# EAGLE schematic Hackerboat Control Board (EAGLE 6.5.0)

## Sheet 1 of 7
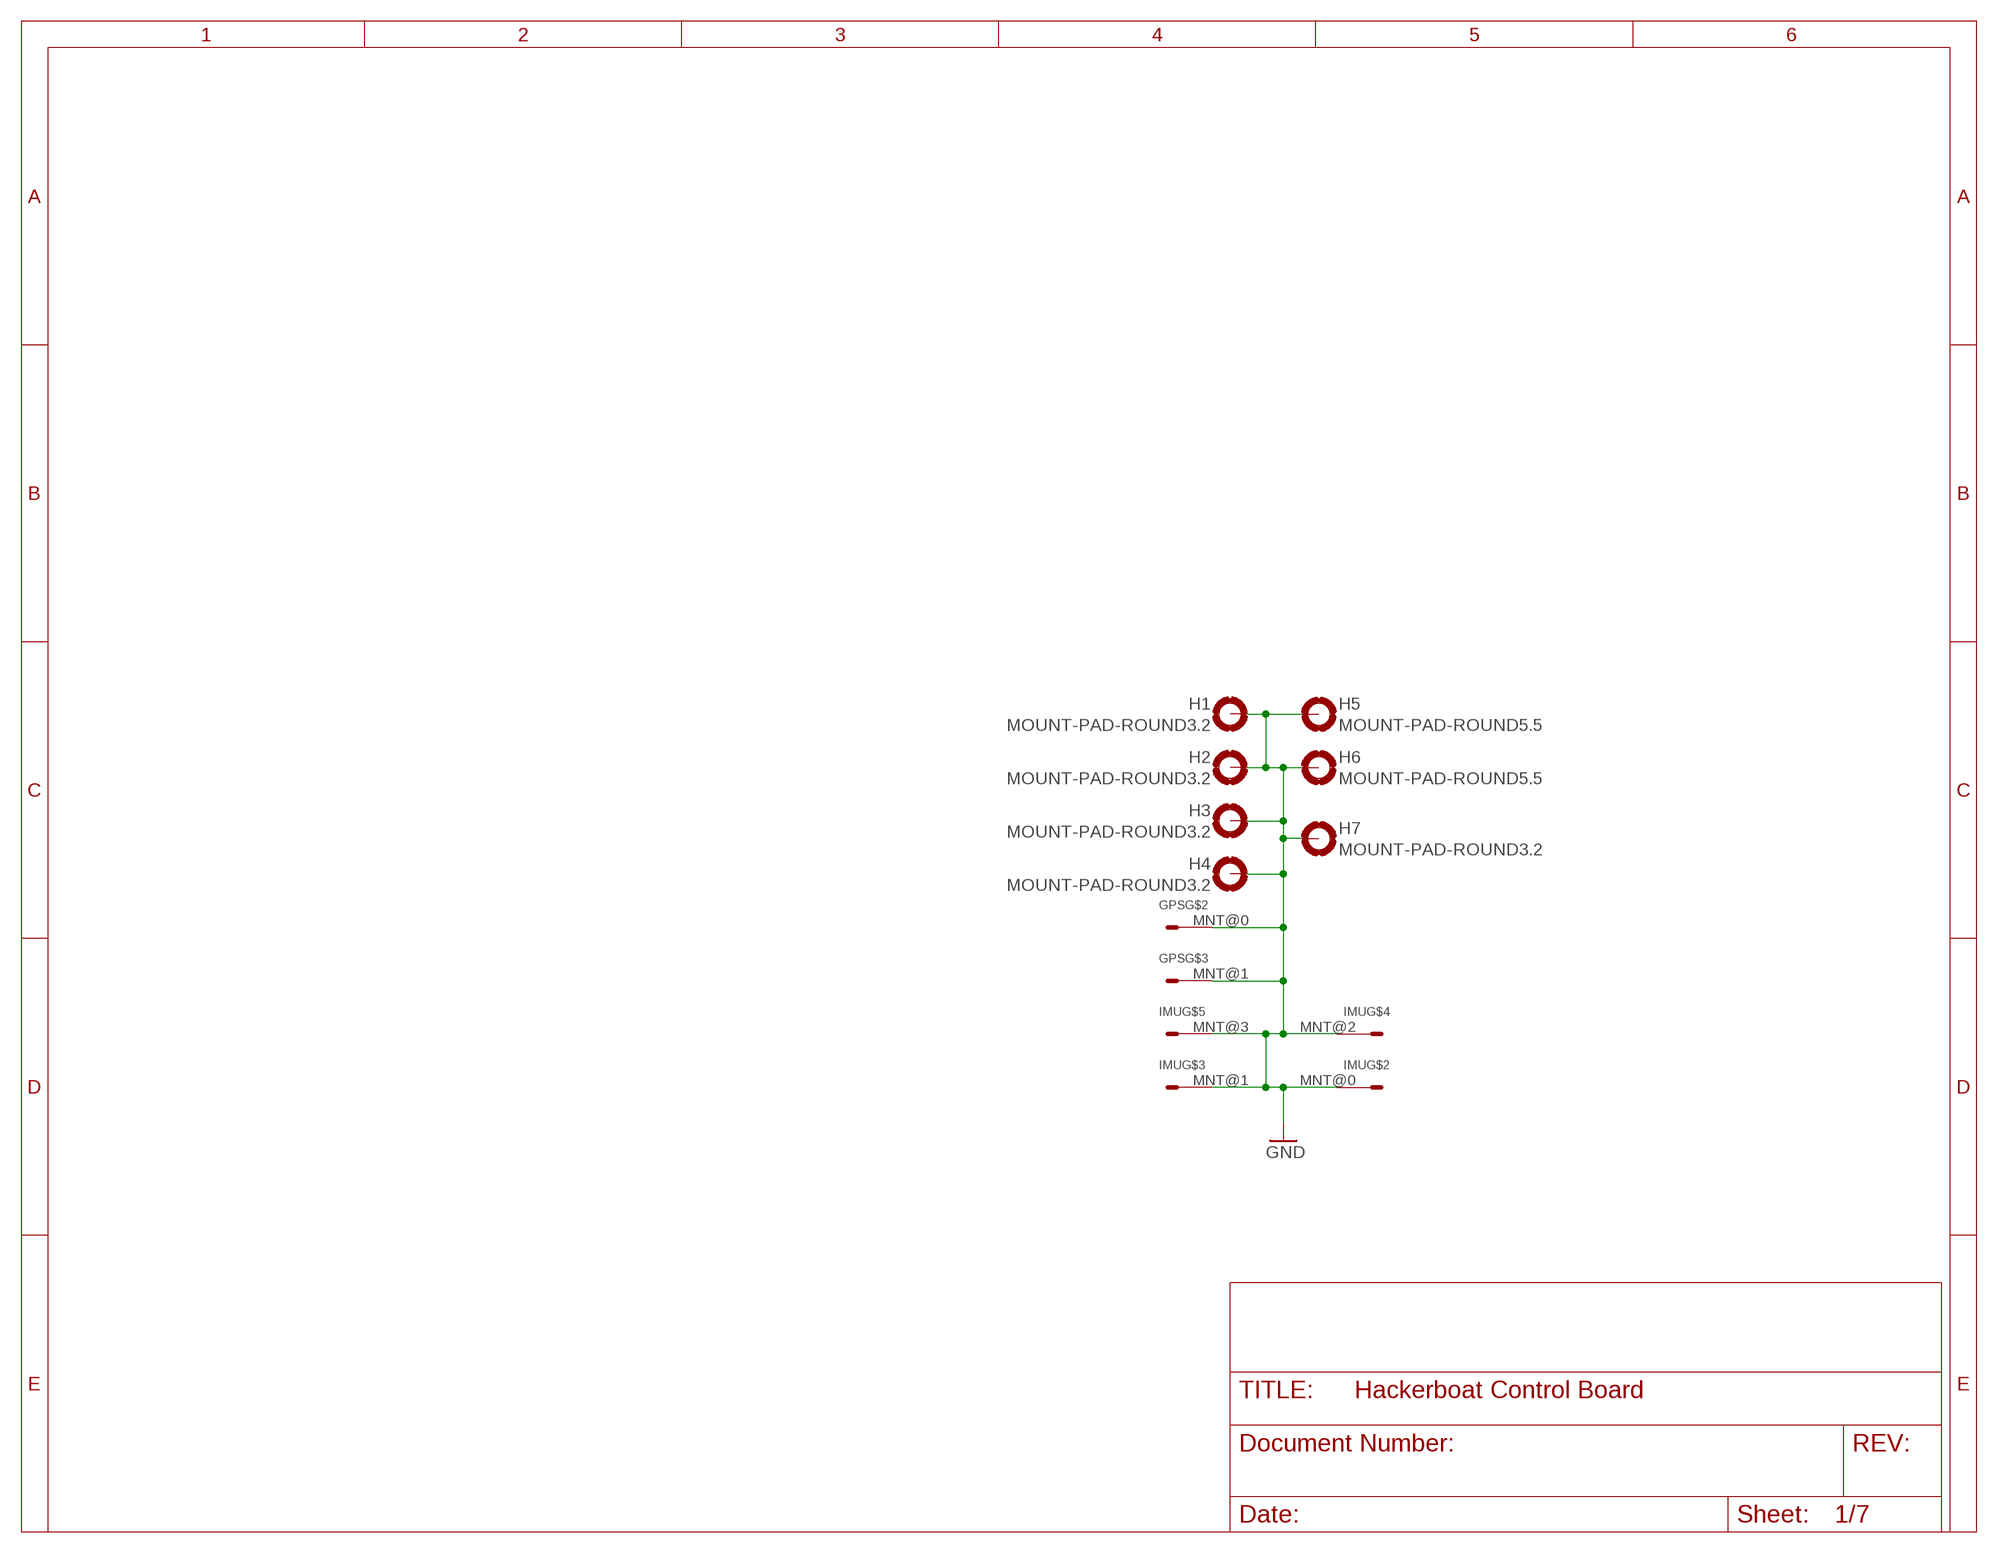
[diagram p0: schematic, sheet 1]

### Parts
GPS  ULTIMATE-GPS  [ULTIMATE-GPS]
H1  MOUNT-PAD-ROUND3.2  [3,2-PAD]
H2  MOUNT-PAD-ROUND3.2  [3,2-PAD]
H3  MOUNT-PAD-ROUND3.2  [3,2-PAD]
H4  MOUNT-PAD-ROUND3.2  [3,2-PAD]
H5  MOUNT-PAD-ROUND5.5  [5,5-PAD]
H6  MOUNT-PAD-ROUND5.5  [5,5-PAD]
H7  MOUNT-PAD-ROUND3.2  [3,2-PAD]
IMU  9-DOF-BREAKOUT  [9-DOF-BREAKOUT]

### Nets
GND: GPS.MNT@0 GPS.MNT@1 H1.B3,2(MOUNT) H2.B3,2(MOUNT) H3.B3,2(MOUNT) H4.B3,2(MOUNT) H5.B5,5(MOUNT) H6.B5,5(MOUNT) H7.B3,2(MOUNT) IMU.MNT@0 IMU.MNT@1 IMU.MNT@2 IMU.MNT@3 ; also sheet 2,3,4,5,6,7

## Sheet 2 of 7
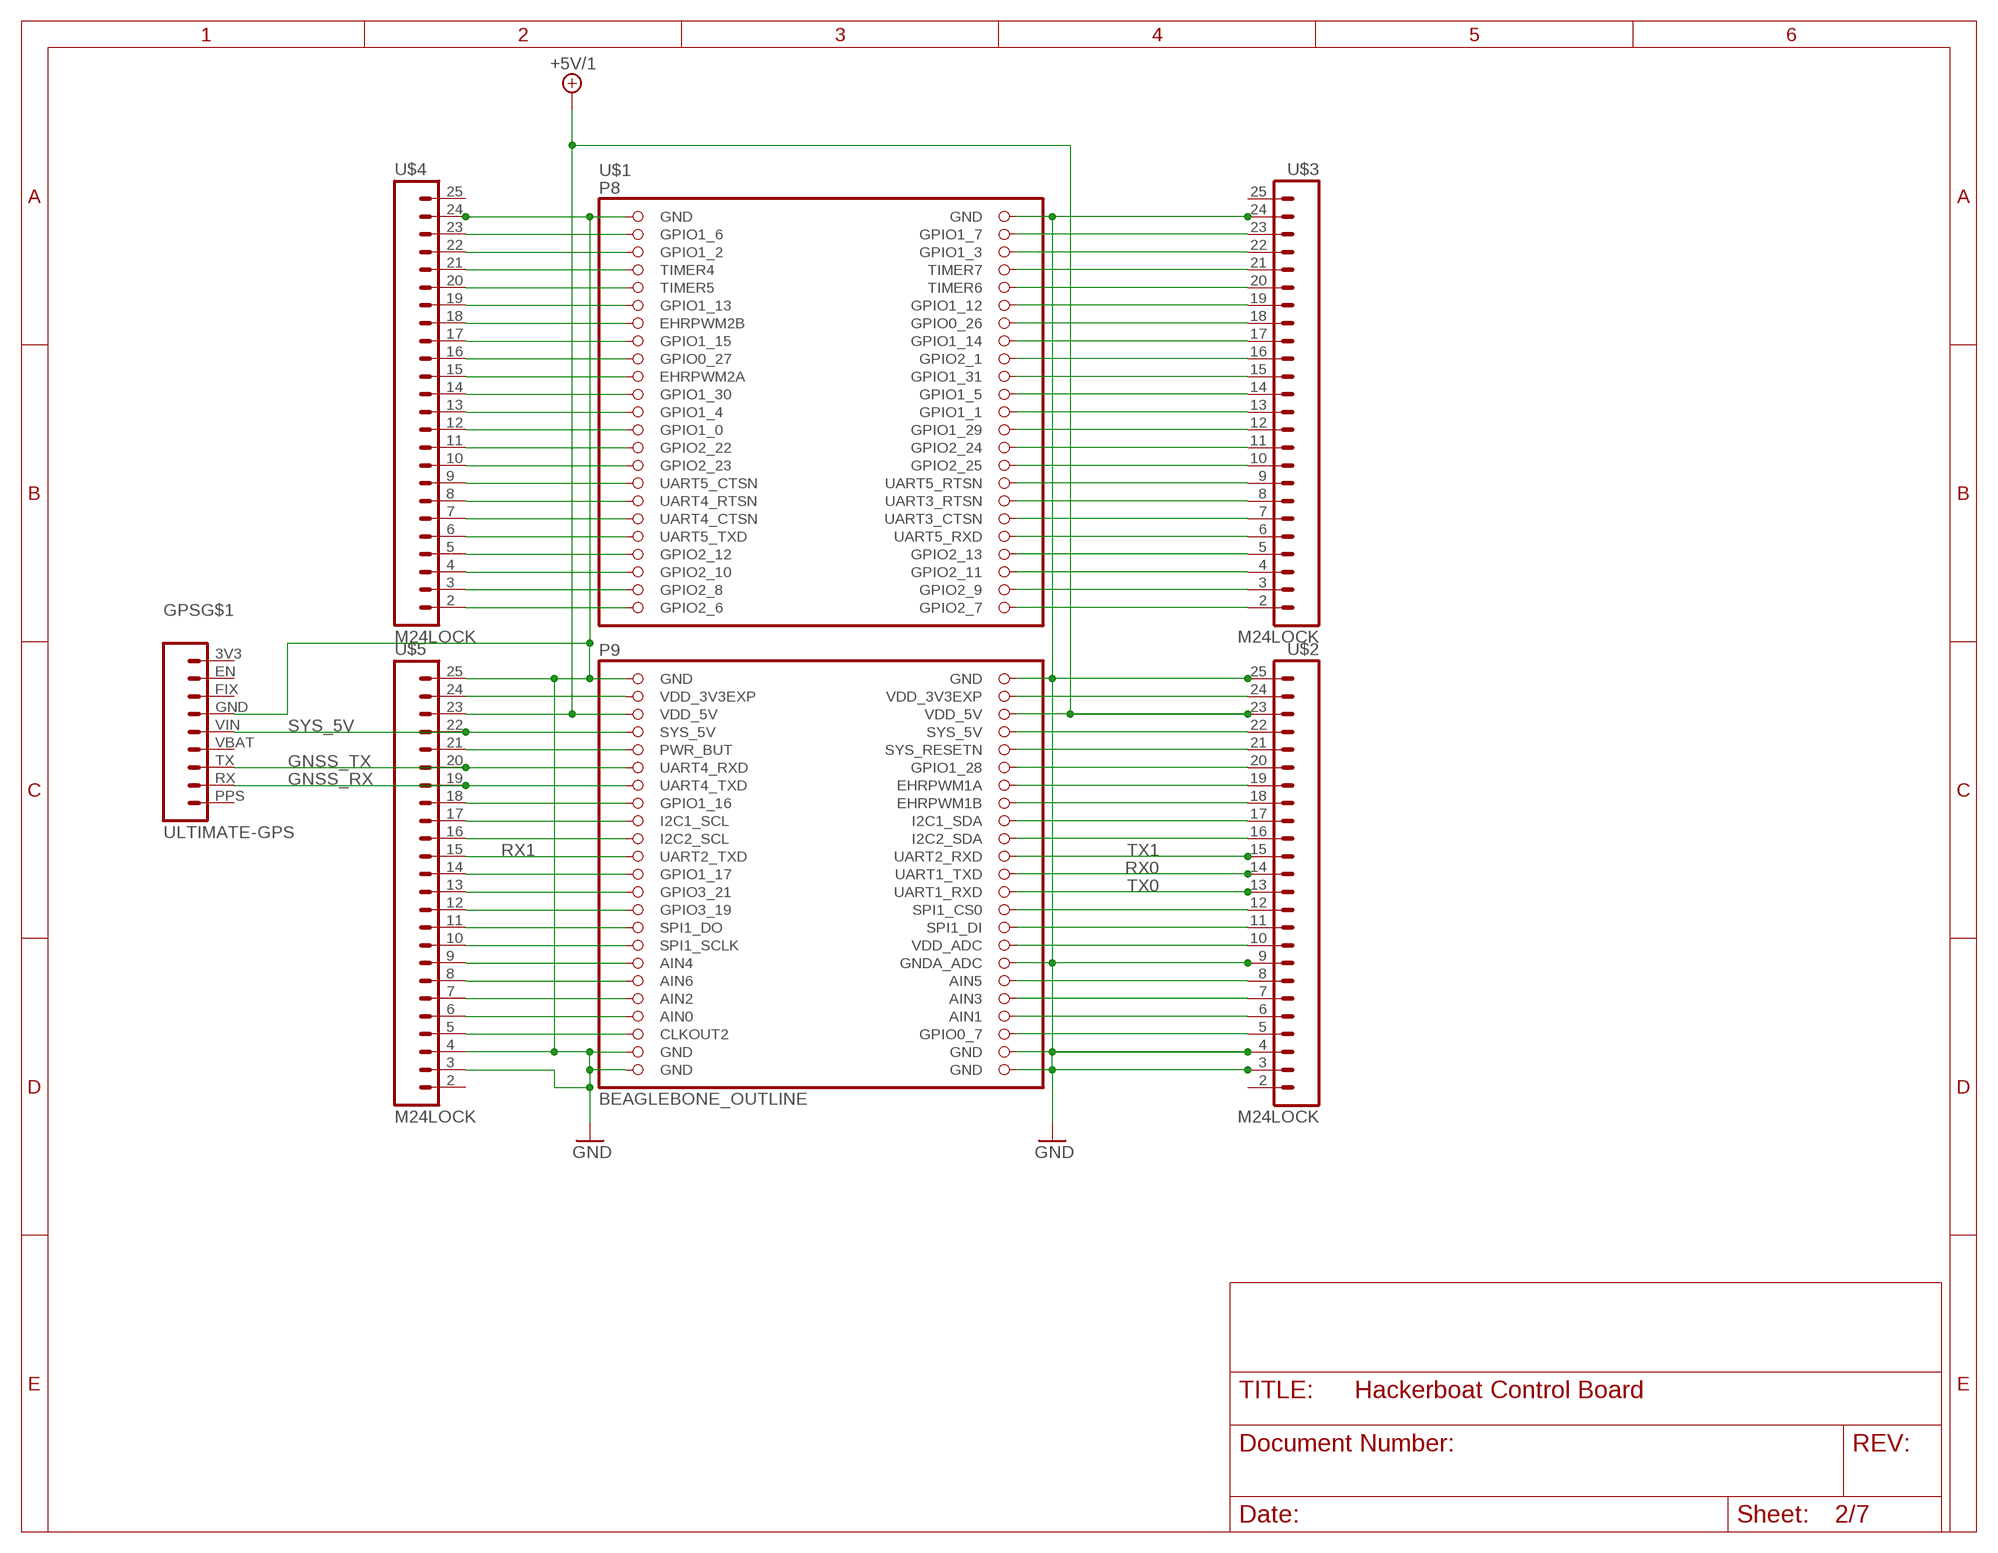
[diagram p1: schematic, sheet 2]

### Parts
U$1  BEAGLEBONE_OUTLINE  [BEAGLEBONE_SHIELD]
U$2  M24LOCK  [1X24_LOCK]
U$3  M24LOCK  [1X24_LOCK]
U$4  M24LOCK  [1X24_LOCK]
U$5  M24LOCK  [1X24_LOCK]

### Nets
+5V/1: U$1.51(VDD_5V) U$1.52(VDD_5V) U$2.23 U$5.23 ; also sheet 6
GND: GPS.GND U$1.1(GND) U$1.2(GND) U$1.47(GND) U$1.48(GND) U$1.80(GNDA_ADC) U$1.89(GND) U$1.90(GND) U$1.91(GND) U$1.92(GND) U$2.3 U$2.4 U$2.9 U$2.25 U$3.24 U$4.24 U$5.3 U$5.4 U$5.25 ; also sheet 1,3,4,5,6,7
GNSS_RX: GPS.RX U$1.59(UART4_TXD) U$5.19
GNSS_TX: GPS.TX U$1.57(UART4_RXD) U$5.20
N$71: U$1.49(VDD_3V3EXP) U$5.24
N$104: U$1.88(GPIO0_7) U$2.5
N$105: U$1.86(AIN1) U$2.6
N$106: U$1.84(AIN3) U$2.7
N$107: U$1.82(AIN5) U$2.8
N$108: U$1.78(VDD_ADC) U$2.10
N$109: U$1.76(SPI1_DI) U$2.11
N$110: U$1.74(SPI1_CS0) U$2.12
N$111: U$1.66(I2C2_SDA) U$2.16
N$112: U$1.64(I2C1_SDA) U$2.17
N$113: U$1.62(EHRPWM1B) U$2.18
N$114: U$1.60(EHRPWM1A) U$2.19
N$115: U$1.58(GPIO1_28) U$2.20
N$116: U$1.56(SYS_RESETN) U$2.21
N$117: U$1.54(SYS_5V) U$2.22
N$118: U$1.50(VDD_3V3EXP) U$2.24
N$119: U$1.46(GPIO2_7) U$3.2
N$120: U$1.44(GPIO2_9) U$3.3
N$121: U$1.42(GPIO2_11) U$3.4
N$122: U$1.40(GPIO2_13) U$3.5
N$123: U$1.38(UART5_RXD) U$3.6
N$124: U$1.36(UART3_CTSN) U$3.7
N$125: U$1.34(UART3_RTSN) U$3.8
N$126: U$1.32(UART5_RTSN) U$3.9
N$127: U$1.30(GPIO2_25) U$3.10
N$128: U$1.28(GPIO2_24) U$3.11
N$129: U$1.26(GPIO1_29) U$3.12
N$130: U$1.24(GPIO1_1) U$3.13
N$131: U$1.22(GPIO1_5) U$3.14
N$132: U$1.20(GPIO1_31) U$3.15
N$133: U$1.18(GPIO2_1) U$3.16
N$134: U$1.16(GPIO1_14) U$3.17
N$135: U$1.14(GPIO0_26) U$3.18
N$136: U$1.12(GPIO1_12) U$3.19
N$137: U$1.10(TIMER6) U$3.20
N$138: U$1.8(TIMER7) U$3.21
N$139: U$1.6(GPIO1_3) U$3.22
N$140: U$1.4(GPIO1_7) U$3.23
N$141: U$1.45(GPIO2_6) U$4.2
N$142: U$1.43(GPIO2_8) U$4.3
N$143: U$1.41(GPIO2_10) U$4.4
N$144: U$1.39(GPIO2_12) U$4.5
N$145: U$1.37(UART5_TXD) U$4.6
N$146: U$1.35(UART4_CTSN) U$4.7
N$147: U$1.33(UART4_RTSN) U$4.8
N$148: U$1.31(UART5_CTSN) U$4.9
N$149: U$1.29(GPIO2_23) U$4.10
N$150: U$1.27(GPIO2_22) U$4.11
N$151: U$1.25(GPIO1_0) U$4.12
N$152: U$1.23(GPIO1_4) U$4.13
N$153: U$1.21(GPIO1_30) U$4.14
N$154: U$1.19(EHRPWM2A) U$4.15
N$155: U$1.17(GPIO0_27) U$4.16
N$156: U$1.15(GPIO1_15) U$4.17
N$157: U$1.13(EHRPWM2B) U$4.18
N$158: U$1.11(GPIO1_13) U$4.19
N$159: U$1.9(TIMER5) U$4.20
N$160: U$1.7(TIMER4) U$4.21
N$161: U$1.5(GPIO1_2) U$4.22
N$162: U$1.3(GPIO1_6) U$4.23
N$163: U$1.87(CLKOUT2) U$5.5
N$164: U$1.85(AIN0) U$5.6
N$165: U$1.83(AIN2) U$5.7
N$166: U$1.81(AIN6) U$5.8
N$167: U$1.79(AIN4) U$5.9
N$168: U$1.77(SPI1_SCLK) U$5.10
N$169: U$1.75(SPI1_DO) U$5.11
N$170: U$1.73(GPIO3_19) U$5.12
N$171: U$1.71(GPIO3_21) U$5.13
N$172: U$1.69(GPIO1_17) U$5.14
N$173: U$1.65(I2C2_SCL) U$5.16
N$174: U$1.63(I2C1_SCL) U$5.17
N$175: U$1.61(GPIO1_16) U$5.18
N$176: U$1.55(PWR_BUT) U$5.21
RX0: U$1.70(UART1_TXD) U$2.14 ; also sheet 3
RX1: U$1.67(UART2_TXD) U$5.15 ; also sheet 3
SYS_5V: GPS.VIN U$1.53(SYS_5V) U$5.22
TX0: U$1.72(UART1_RXD) U$2.13 ; also sheet 3
TX1: U$1.68(UART2_RXD) U$2.15 ; also sheet 3
Unconnected: GPS.3V3 GPS.EN GPS.FIX GPS.PPS GPS.VBAT U$2.2 U$3.25 U$4.25 U$5.2

## Sheet 3 of 7
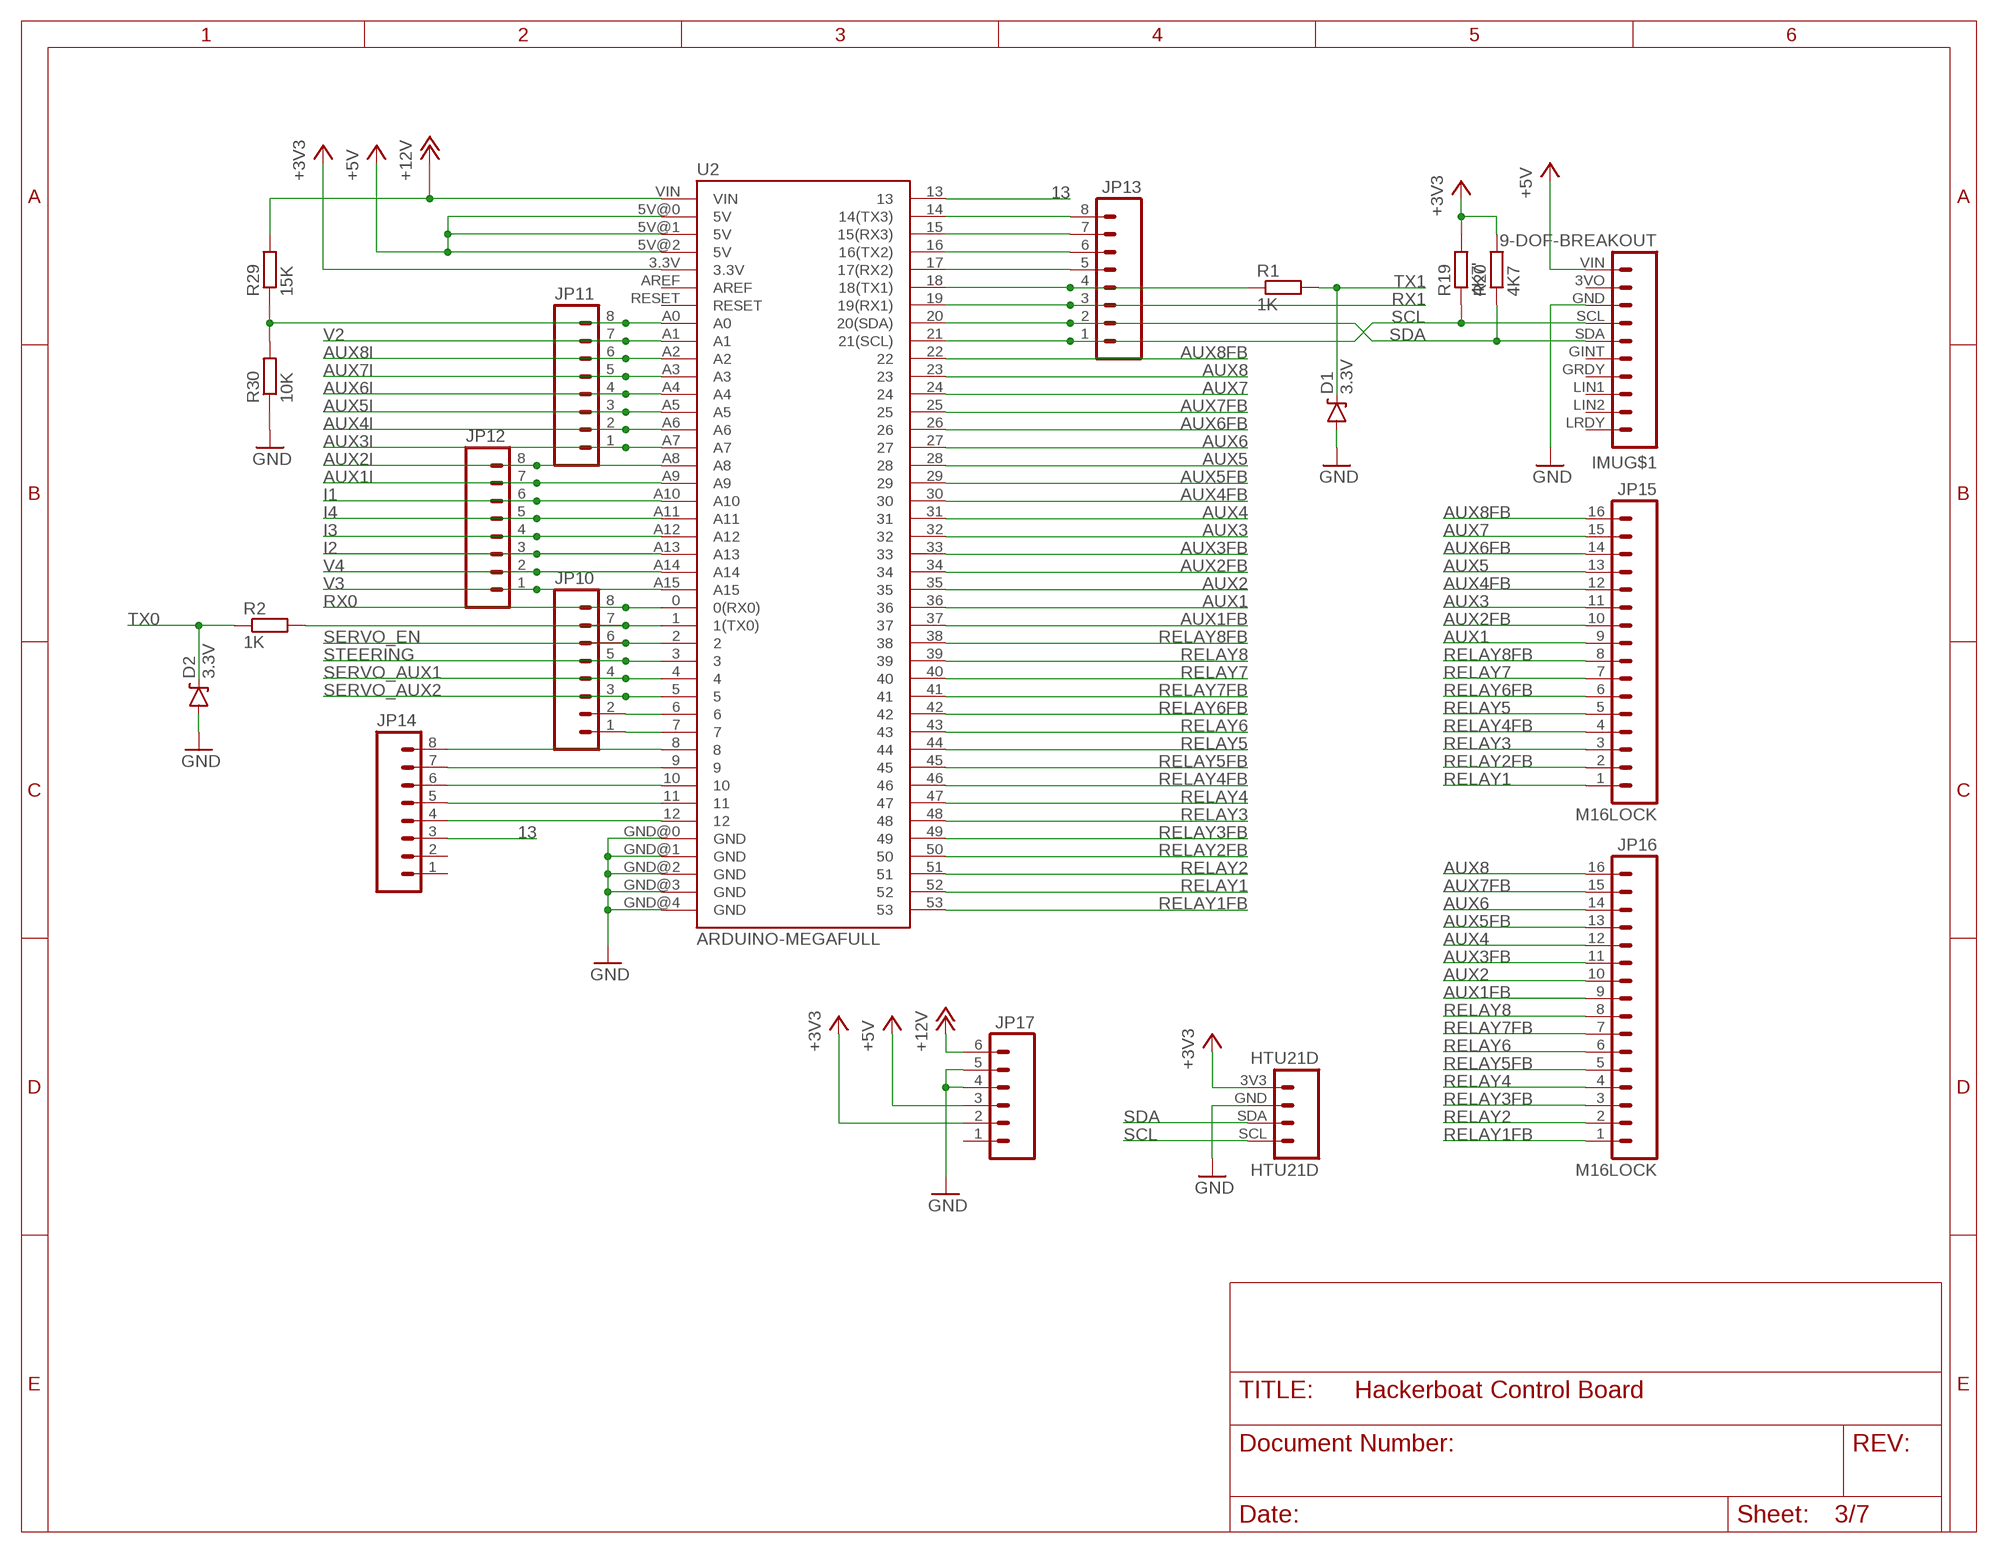
[diagram p2: schematic, sheet 3]

### Parts
D1  3.3V  DIODE-ZENER3.3V  [SOD-323]
D2  3.3V  DIODE-ZENER3.3V  [SOD-323]
HTU21D  HTU21D  [HTU21D]
JP10  M08LOCK  [1X08_LOCK]
JP11  M08LOCK  [1X08_LOCK]
JP12  M08LOCK  [1X08_LOCK]
JP13  M08LOCK  [1X08_LOCK]
JP14  M08LOCK  [1X08_LOCK]
JP15  M16LOCK  [1X16_LOCK]
JP16  M16LOCK  [1X16_LOCK]
JP17  M06LOCK  [1X06_LOCK]
R1  1K  R-EU_R0603  [R0603]
R2  1K  R-EU_R0603  [R0603]
R19  4K7'  R-EU_R0603  [R0603]
R20  4K7  R-EU_R0603  [R0603]
R29  15K  R-EU_R0603  [R0603]
R30  10K  R-EU_R0603  [R0603]
U2  ARDUINO-MEGAFULL  [ARDUINO_MEGA]

### Nets
13: JP14.3 U2.13
+3V3: HTU21D.3V3 JP17.2 R19.2 R20.2 U2.3.3V
+5V: IMU.VIN JP17.3 U2.5V@0(5V) U2.5V@1(5V) U2.5V@2(5V) ; also sheet 4,5,7
+12V: JP17.6 R29.2 U2.VIN ; also sheet 4,5,6
AUX1: JP15.9 U2.36 ; also sheet 5
AUX1FB: JP16.9 U2.37 ; also sheet 5
AUX1I: JP12.7 U2.A9 ; also sheet 5
AUX2: JP16.10 U2.35 ; also sheet 5
AUX2FB: JP15.10 U2.34 ; also sheet 5
AUX2I: JP12.8 U2.A8 ; also sheet 5
AUX3: JP15.11 U2.32 ; also sheet 5
AUX3FB: JP16.11 U2.33 ; also sheet 5
AUX3I: JP11.1 U2.A7 ; also sheet 5
AUX4: JP16.12 U2.31 ; also sheet 5
AUX4FB: JP15.12 U2.30 ; also sheet 5
AUX4I: JP11.2 U2.A6 ; also sheet 5
AUX5: JP15.13 U2.28 ; also sheet 5
AUX5FB: JP16.13 U2.29 ; also sheet 5
AUX5I: JP11.3 U2.A5 ; also sheet 5
AUX6: JP16.14 U2.27 ; also sheet 5
AUX6FB: JP15.14 U2.26 ; also sheet 5
AUX6I: JP11.4 U2.A4 ; also sheet 5
AUX7: JP15.15 U2.24 ; also sheet 5
AUX7FB: JP16.15 U2.25 ; also sheet 5
AUX7I: JP11.5 U2.A3 ; also sheet 5
AUX8: JP16.16 U2.23 ; also sheet 5
AUX8FB: JP15.16 U2.22 ; also sheet 5
AUX8I: JP11.6 U2.A2 ; also sheet 5
GND: D1.A D2.A HTU21D.GND IMU.GND JP17.4 JP17.5 R30.1 U2.GND@0(GND) U2.GND@1(GND) U2.GND@2(GND) U2.GND@3(GND) U2.GND@4(GND) ; also sheet 1,2,4,5,6,7
I1: JP12.6 U2.A10 ; also sheet 7
I2: JP12.3 U2.A13 ; also sheet 7
I3: JP12.4 U2.A12 ; also sheet 7
I4: JP12.5 U2.A11 ; also sheet 7
N$3: JP13.4 R1.1 U2.18(18(TX1))
N$4: JP10.7 R2.2 U2.1(1(TX0))
N$91: JP10.1 U2.7
N$92: JP10.2 U2.6
N$94: JP11.8 R29.1 R30.2 U2.A0
N$95: JP13.5 U2.17(17(RX2))
N$96: JP13.6 U2.16(16(TX2))
N$97: JP13.7 U2.15(15(RX3))
N$98: JP13.8 U2.14(14(TX3))
N$99: JP14.8 U2.8
N$100: JP14.7 U2.9
N$101: JP14.6 U2.10
N$102: JP14.5 U2.11
N$103: JP14.4 U2.12
RELAY1: JP15.1 U2.52 ; also sheet 4
RELAY1FB: JP16.1 U2.53 ; also sheet 4
RELAY2: JP16.2 U2.51 ; also sheet 4
RELAY2FB: JP15.2 U2.50 ; also sheet 4
RELAY3: JP15.3 U2.48 ; also sheet 4
RELAY3FB: JP16.3 U2.49 ; also sheet 4
RELAY4: JP16.4 U2.47 ; also sheet 4
RELAY4FB: JP15.4 U2.46 ; also sheet 4
RELAY5: JP15.5 U2.44 ; also sheet 4
RELAY5FB: JP16.5 U2.45 ; also sheet 4
RELAY6: JP16.6 U2.43 ; also sheet 4
RELAY6FB: JP15.6 U2.42 ; also sheet 4
RELAY7: JP15.7 U2.40 ; also sheet 4
RELAY7FB: JP16.7 U2.41 ; also sheet 4
RELAY8: JP16.8 U2.39 ; also sheet 4
RELAY8FB: JP15.8 U2.38 ; also sheet 4
RX0: JP10.8 U2.0(0(RX0)) ; also sheet 2
RX1: JP13.3 U2.19(19(RX1)) ; also sheet 2
SCL: HTU21D.SCL IMU.SCL JP13.1 R19.1 U2.21(21(SCL))
SDA: HTU21D.SDA IMU.SDA JP13.2 R20.1 U2.20(20(SDA))
SERVO_AUX1: JP10.4 U2.4 ; also sheet 7
SERVO_AUX2: JP10.3 U2.5 ; also sheet 7
SERVO_EN: JP10.6 U2.2 ; also sheet 6
STEERING: JP10.5 U2.3 ; also sheet 7
TX0: D2.C R2.1 ; also sheet 2
TX1: D1.C R1.2 ; also sheet 2
V2: JP11.7 U2.A1 ; also sheet 7
V3: JP12.1 U2.A15 ; also sheet 7
V4: JP12.2 U2.A14 ; also sheet 7
Unconnected: IMU.3VO IMU.GINT IMU.GRDY IMU.LIN1 IMU.LIN2 IMU.LRDY JP14.1 JP14.2 JP17.1 U2.AREF U2.RESET

## Sheet 4 of 7
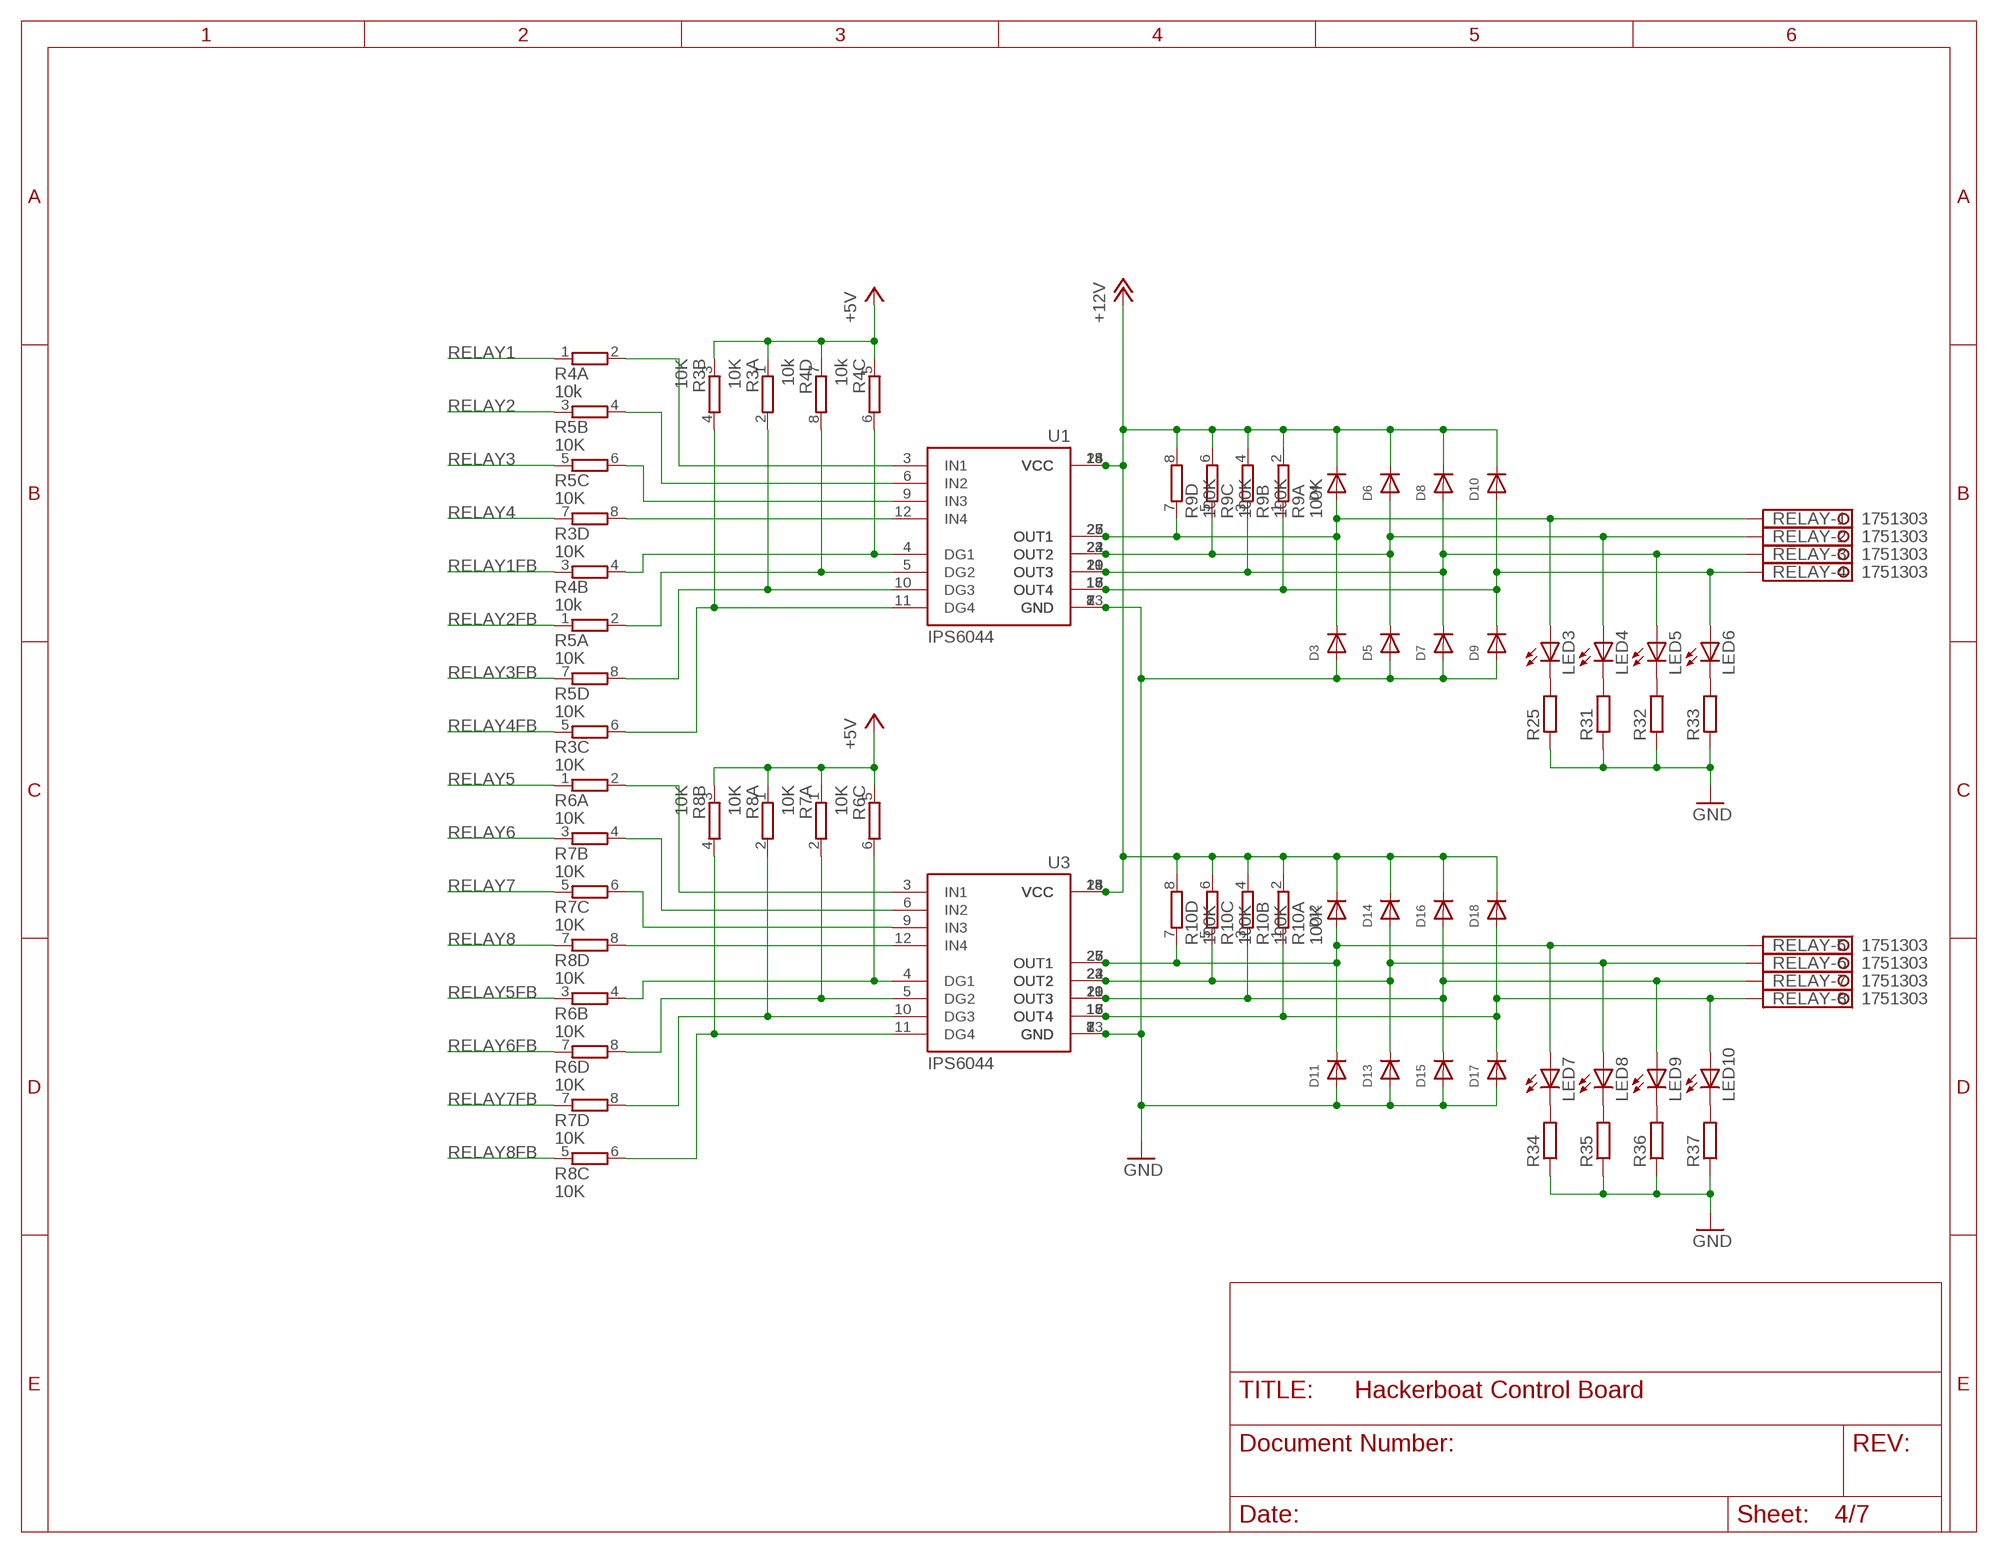
[diagram p3: schematic, sheet 4]

### Parts
D3  DIODESOD-123  [SOD-123]
D4  DIODESOD-123  [SOD-123]
D5  DIODESOD-123  [SOD-123]
D6  DIODESOD-123  [SOD-123]
D7  DIODESOD-123  [SOD-123]
D8  DIODESOD-123  [SOD-123]
D9  DIODESOD-123  [SOD-123]
D10  DIODESOD-123  [SOD-123]
D11  DIODESOD-123  [SOD-123]
D12  DIODESOD-123  [SOD-123]
D13  DIODESOD-123  [SOD-123]
D14  DIODESOD-123  [SOD-123]
D15  DIODESOD-123  [SOD-123]
D16  DIODESOD-123  [SOD-123]
D17  DIODESOD-123  [SOD-123]
D18  DIODESOD-123  [SOD-123]
LED3  LEDCHIPLED_0805  [CHIPLED_0805]
LED4  LEDCHIPLED_0805  [CHIPLED_0805]
LED5  LEDCHIPLED_0805  [CHIPLED_0805]
LED6  LEDCHIPLED_0805  [CHIPLED_0805]
LED7  LEDCHIPLED_0805  [CHIPLED_0805]
LED8  LEDCHIPLED_0805  [CHIPLED_0805]
LED9  LEDCHIPLED_0805  [CHIPLED_0805]
LED10  LEDCHIPLED_0805  [CHIPLED_0805]
R3  10K  4R-NCTS742C083  [CTS742C083-RES]
R4  10k  4R-NCTS742C083  [CTS742C083-RES]
R5  10K  4R-NCTS742C083  [CTS742C083-RES]
R6  10K  4R-NCTS742C083  [CTS742C083-RES]
R7  10K  4R-NCTS742C083  [CTS742C083-RES]
R8  10K  4R-NCTS742C083  [CTS742C083-RES]
R9  100K  4R-NCTS742C083  [CTS742C083-RES]
R10  100K  4R-NCTS742C083  [CTS742C083-RES]
R25  R-EU_R0603  [R0603]
R31  R-EU_R0603  [R0603]
R32  R-EU_R0603  [R0603]
R33  R-EU_R0603  [R0603]
R34  R-EU_R0603  [R0603]
R35  R-EU_R0603  [R0603]
R36  R-EU_R0603  [R0603]
R37  R-EU_R0603  [R0603]
RELAY  1751303  [1751303]
U1  IPS6044  [SO-28L]
U3  IPS6044  [SO-28L]

### Nets
+5V: R3.1 R3.3 R4.5 R4.7 R6.5 R7.1 R8.1 R8.3 ; also sheet 3,5,7
+12V: D4.C D6.C D8.C D10.C D12.C D14.C D16.C D18.C R9.2 R9.4 R9.6 R9.8 R10.2 R10.4 R10.6 R10.8 U1.1(VCC) U1.14(VCC) U1.15(VCC) U1.28(VCC) U3.1(VCC) U3.14(VCC) U3.15(VCC) U3.28(VCC) ; also sheet 3,5,6
GND: D3.A D5.A D7.A D9.A D11.A D13.A D15.A D17.A R25.1 R31.1 R32.1 R33.1 R34.1 R35.1 R36.1 R37.1 U1.2(GND) U1.7(GND) U1.8(GND) U1.13(GND) U3.2(GND) U3.7(GND) U3.8(GND) U3.13(GND) ; also sheet 1,2,3,5,6,7
N$5: R6.2 U3.3(IN1)
N$6: R8.8 U3.12(IN4)
N$7: R7.6 U3.9(IN3)
N$8: D3.C D4.A LED3.A R9.7 RELAY.1 U1.25(OUT1) U1.26(OUT1) U1.27(OUT1)
N$9: D5.C D6.A LED4.A R9.5 RELAY.2 U1.22(OUT2) U1.23(OUT2) U1.24(OUT2)
N$10: D7.C D8.A LED5.A R9.3 RELAY.3 U1.19(OUT3) U1.20(OUT3) U1.21(OUT3)
N$11: D9.C D10.A LED6.A R9.1 RELAY.4 U1.16(OUT4) U1.17(OUT4) U1.18(OUT4)
N$12: R4.2 U1.3(IN1)
N$13: R5.4 U1.6(IN2)
N$14: R5.6 U1.9(IN3)
N$15: R3.8 U1.12(IN4)
N$16: R4.4 R4.6 U1.4(DG1)
N$17: R4.8 R5.2 U1.5(DG2)
N$18: R3.2 R5.8 U1.10(DG3)
N$19: R3.4 R3.6 U1.11(DG4)
N$20: R7.4 U3.6(IN2)
N$21: R6.8 R7.2 U3.5(DG2)
N$22: R6.4 R6.6 U3.4(DG1)
N$23: R7.8 R8.2 U3.10(DG3)
N$24: R8.4 R8.6 U3.11(DG4)
N$25: D11.C D12.A LED7.A R10.7 RELAY.5 U3.25(OUT1) U3.26(OUT1) U3.27(OUT1)
N$26: D13.C D14.A LED8.A R10.5 RELAY.6 U3.22(OUT2) U3.23(OUT2) U3.24(OUT2)
N$27: D15.C D16.A LED9.A R10.3 RELAY.7 U3.19(OUT3) U3.20(OUT3) U3.21(OUT3)
N$28: D17.C D18.A LED10.A R10.1 RELAY.8 U3.16(OUT4) U3.17(OUT4) U3.18(OUT4)
N$178: LED3.C R25.2
N$179: LED4.C R31.2
N$180: LED5.C R32.2
N$181: LED6.C R33.2
N$186: LED7.C R34.2
N$187: LED8.C R35.2
N$188: LED9.C R36.2
N$189: LED10.C R37.2
RELAY1: R4.1 ; also sheet 3
RELAY1FB: R4.3 ; also sheet 3
RELAY2: R5.3 ; also sheet 3
RELAY2FB: R5.1 ; also sheet 3
RELAY3: R5.5 ; also sheet 3
RELAY3FB: R5.7 ; also sheet 3
RELAY4: R3.7 ; also sheet 3
RELAY4FB: R3.5 ; also sheet 3
RELAY5: R6.1 ; also sheet 3
RELAY5FB: R6.3 ; also sheet 3
RELAY6: R7.3 ; also sheet 3
RELAY6FB: R6.7 ; also sheet 3
RELAY7: R7.5 ; also sheet 3
RELAY7FB: R7.7 ; also sheet 3
RELAY8: R8.7 ; also sheet 3
RELAY8FB: R8.5 ; also sheet 3

## Sheet 5 of 7
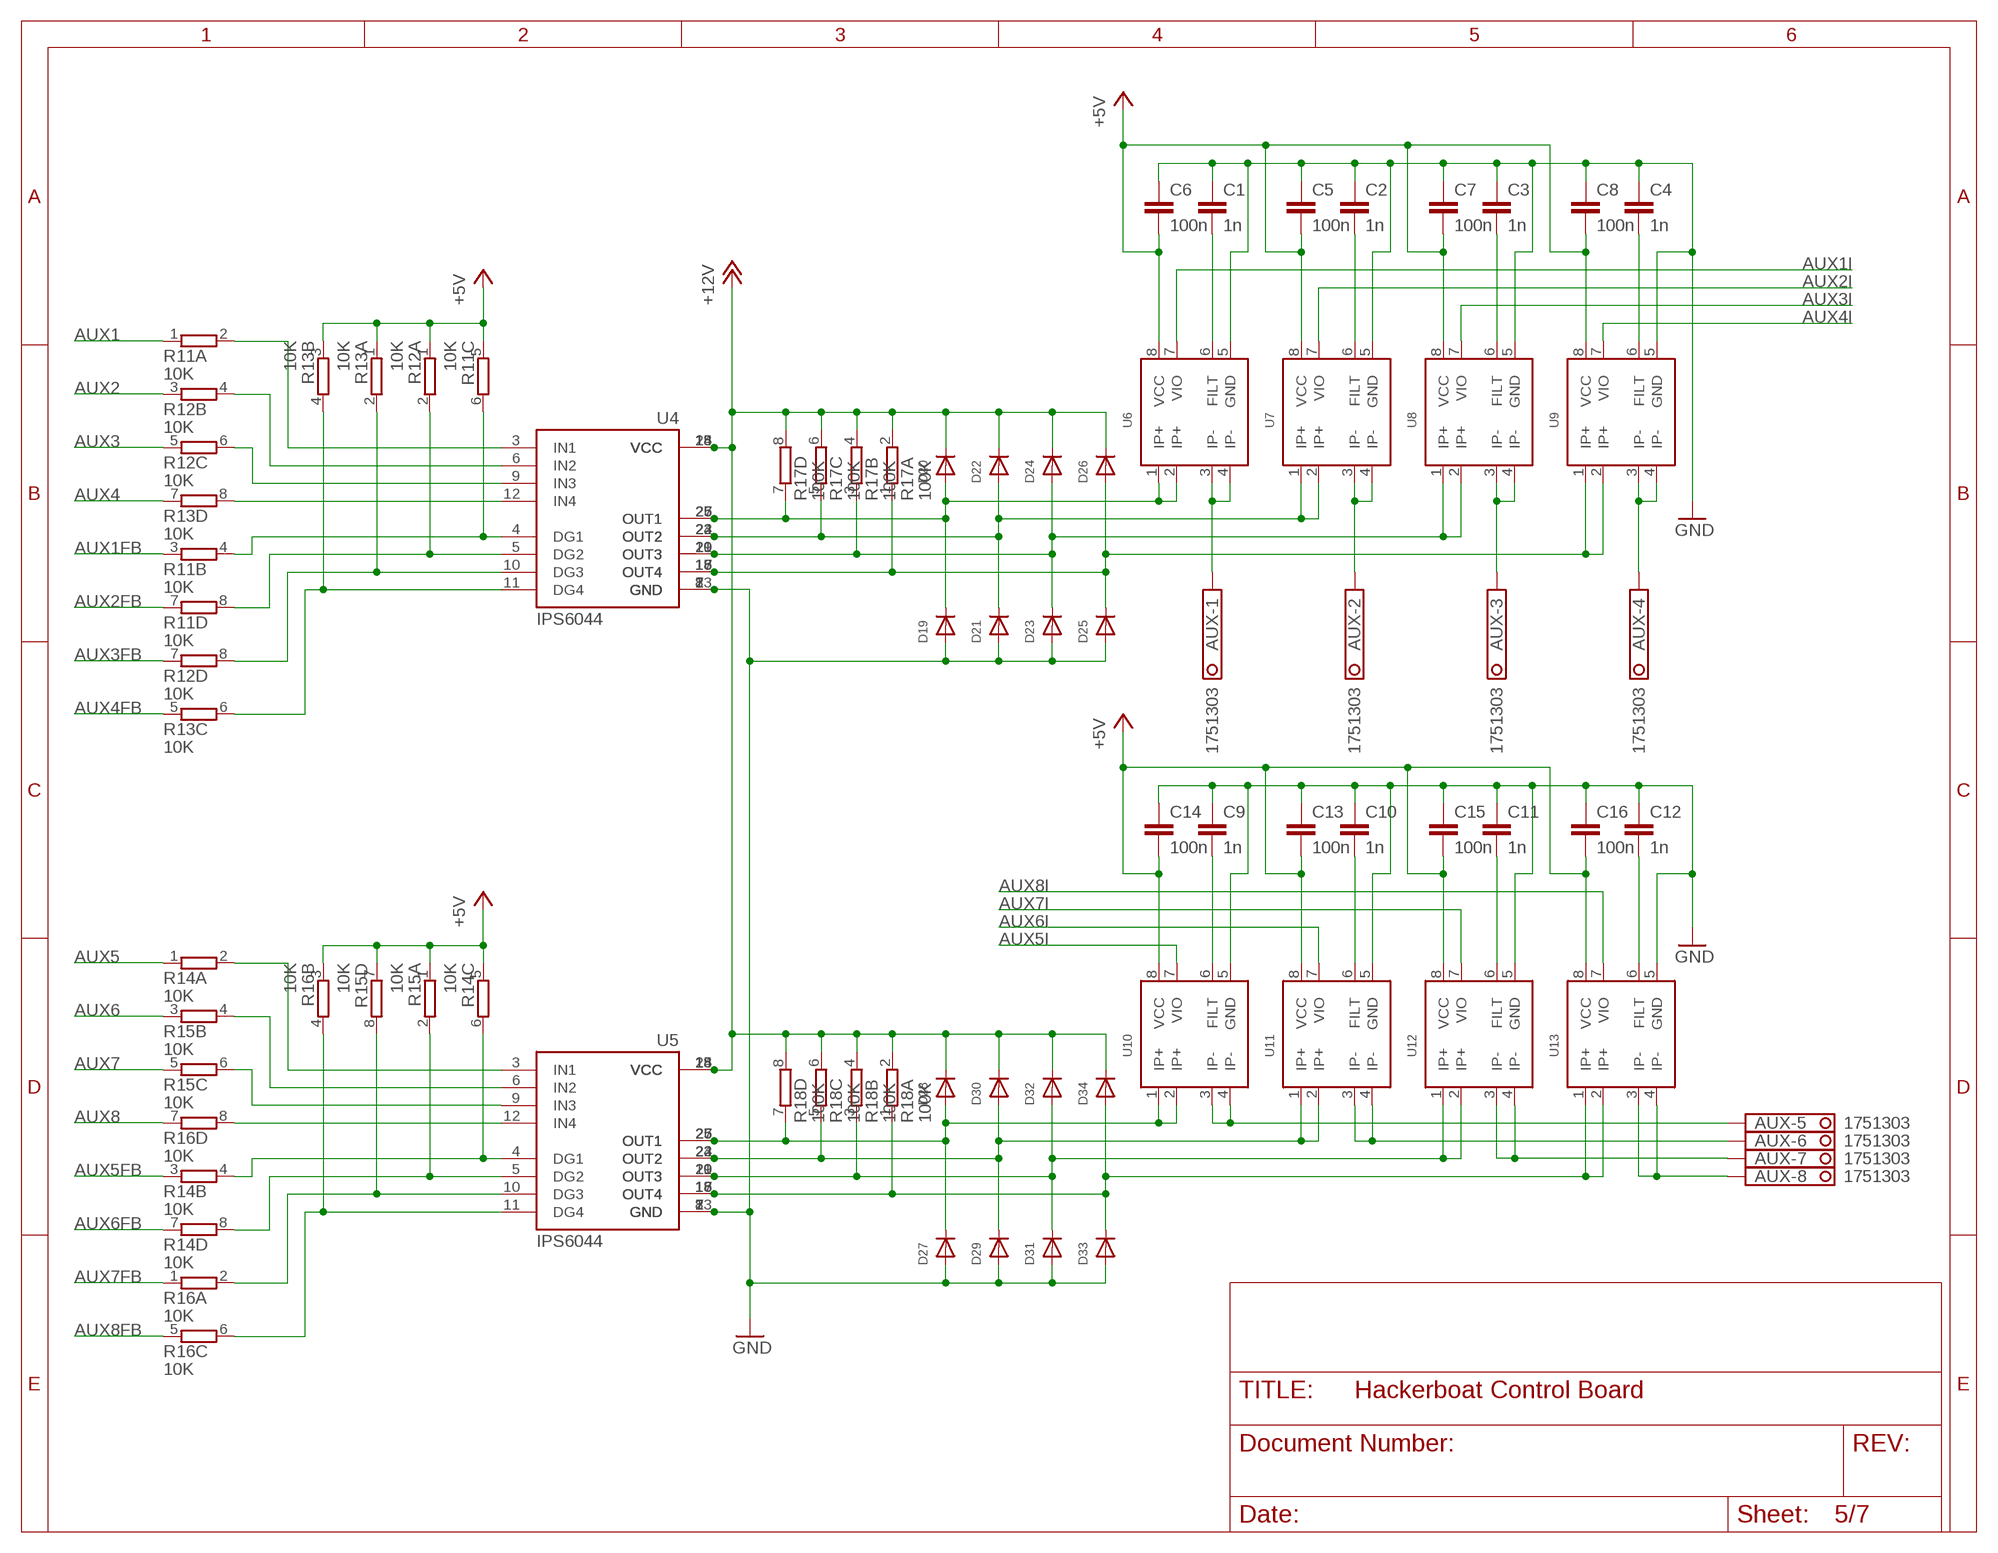
[diagram p4: schematic, sheet 5]

### Parts
AUX  1751303  [1751303]
C1  1n  C-EUC0603  [C0603]
C2  1n  C-EUC0603  [C0603]
C3  1n  C-EUC0603  [C0603]
C4  1n  C-EUC0603  [C0603]
C5  100n  C-EUC0603  [C0603]
C6  100n  C-EUC0603  [C0603]
C7  100n  C-EUC0603  [C0603]
C8  100n  C-EUC0603  [C0603]
C9  1n  C-EUC0603  [C0603]
C10  1n  C-EUC0603  [C0603]
C11  1n  C-EUC0603  [C0603]
C12  1n  C-EUC0603  [C0603]
C13  100n  C-EUC0603  [C0603]
C14  100n  C-EUC0603  [C0603]
C15  100n  C-EUC0603  [C0603]
C16  100n  C-EUC0603  [C0603]
D19  DIODESOD-123  [SOD-123]
D20  DIODESOD-123  [SOD-123]
D21  DIODESOD-123  [SOD-123]
D22  DIODESOD-123  [SOD-123]
D23  DIODESOD-123  [SOD-123]
D24  DIODESOD-123  [SOD-123]
D25  DIODESOD-123  [SOD-123]
D26  DIODESOD-123  [SOD-123]
D27  DIODESOD-123  [SOD-123]
D28  DIODESOD-123  [SOD-123]
D29  DIODESOD-123  [SOD-123]
D30  DIODESOD-123  [SOD-123]
D31  DIODESOD-123  [SOD-123]
D32  DIODESOD-123  [SOD-123]
D33  DIODESOD-123  [SOD-123]
D34  DIODESOD-123  [SOD-123]
R11  10K  4R-NCTS742C083  [CTS742C083-RES]
R12  10K  4R-NCTS742C083  [CTS742C083-RES]
R13  10K  4R-NCTS742C083  [CTS742C083-RES]
R14  10K  4R-NCTS742C083  [CTS742C083-RES]
R15  10K  4R-NCTS742C083  [CTS742C083-RES]
R16  10K  4R-NCTS742C083  [CTS742C083-RES]
R17  100K  4R-NCTS742C083  [CTS742C083-RES]
R18  100K  4R-NCTS742C083  [CTS742C083-RES]
U4  IPS6044  [SO-28L]
U5  IPS6044  [SO-28L]
U6  ACS712  [SO08]
U7  ACS712  [SO08]
U8  ACS712  [SO08]
U9  ACS712  [SO08]
U10  ACS712  [SO08]
U11  ACS712  [SO08]
U12  ACS712  [SO08]
U13  ACS712  [SO08]

### Nets
+5V: C5.2 C6.2 C7.2 C8.2 C13.2 C14.2 C15.2 C16.2 R11.5 R12.1 R13.1 R13.3 R14.5 R15.1 R15.7 R16.3 U6.8(VCC) U7.8(VCC) U8.8(VCC) U9.8(VCC) U10.8(VCC) U11.8(VCC) U12.8(VCC) U13.8(VCC) ; also sheet 3,4,7
+12V: D20.C D22.C D24.C D26.C D28.C D30.C D32.C D34.C R17.2 R17.4 R17.6 R17.8 R18.2 R18.4 R18.6 R18.8 U4.1(VCC) U4.14(VCC) U4.15(VCC) U4.28(VCC) U5.1(VCC) U5.14(VCC) U5.15(VCC) U5.28(VCC) ; also sheet 3,4,6
AUX1: R11.1 ; also sheet 3
AUX1FB: R11.3 ; also sheet 3
AUX1I: U6.7(VIO) ; also sheet 3
AUX2: R12.3 ; also sheet 3
AUX2FB: R11.7 ; also sheet 3
AUX2I: U7.7(VIO) ; also sheet 3
AUX3: R12.5 ; also sheet 3
AUX3FB: R12.7 ; also sheet 3
AUX3I: U8.7(VIO) ; also sheet 3
AUX4: R13.7 ; also sheet 3
AUX4FB: R13.5 ; also sheet 3
AUX4I: U9.7(VIO) ; also sheet 3
AUX5: R14.1 ; also sheet 3
AUX5FB: R14.3 ; also sheet 3
AUX5I: U10.7(VIO) ; also sheet 3
AUX6: R15.3 ; also sheet 3
AUX6FB: R14.7 ; also sheet 3
AUX6I: U11.7(VIO) ; also sheet 3
AUX7: R15.5 ; also sheet 3
AUX7FB: R16.1 ; also sheet 3
AUX7I: U12.7(VIO) ; also sheet 3
AUX8: R16.7 ; also sheet 3
AUX8FB: R16.5 ; also sheet 3
AUX8I: U13.7(VIO) ; also sheet 3
GND: C1.1 C2.1 C3.1 C4.1 C5.1 C6.1 C7.1 C8.1 C9.1 C10.1 C11.1 C12.1 C13.1 C14.1 C15.1 C16.1 D19.A D21.A D23.A D25.A D27.A D29.A D31.A D33.A U4.2(GND) U4.7(GND) U4.8(GND) U4.13(GND) U5.2(GND) U5.7(GND) U5.8(GND) U5.13(GND) U6.5(GND) U7.5(GND) U8.5(GND) U9.5(GND) U10.5(GND) U11.5(GND) U12.5(GND) U13.5(GND) ; also sheet 1,2,3,4,6,7
N$29: D25.C D26.A R17.1 U4.16(OUT4) U4.17(OUT4) U4.18(OUT4) U9.1(IP+) U9.2(IP+)
N$30: AUX.2 U7.3(IP-) U7.4(IP-)
N$31: AUX.3 U8.3(IP-) U8.4(IP-)
N$32: AUX.4 U9.3(IP-) U9.4(IP-)
N$33: AUX.5 U10.3(IP-) U10.4(IP-)
N$34: D19.C D20.A R17.7 U4.25(OUT1) U4.26(OUT1) U4.27(OUT1) U6.1(IP+) U6.2(IP+)
N$35: D21.C D22.A R17.5 U4.22(OUT2) U4.23(OUT2) U4.24(OUT2) U7.1(IP+) U7.2(IP+)
N$36: D23.C D24.A R17.3 U4.19(OUT3) U4.20(OUT3) U4.21(OUT3) U8.1(IP+) U8.2(IP+)
N$37: AUX.1 U6.3(IP-) U6.4(IP-)
N$38: R11.2 U4.3(IN1)
N$39: R12.4 U4.6(IN2)
N$40: R12.6 U4.9(IN3)
N$41: R13.8 U4.12(IN4)
N$42: R11.4 R11.6 U4.4(DG1)
N$43: R11.8 R12.2 U4.5(DG2)
N$44: R12.8 R13.2 U4.10(DG3)
N$45: R13.4 R13.6 U4.11(DG4)
N$46: R14.2 U5.3(IN1)
N$47: R16.8 U5.12(IN4)
N$48: R15.6 U5.9(IN3)
N$49: R15.4 U5.6(IN2)
N$50: R14.4 R14.6 U5.4(DG1)
N$51: R14.8 R15.2 U5.5(DG2)
N$52: R15.8 R16.2 U5.10(DG3)
N$53: R16.4 R16.6 U5.11(DG4)
N$54: D27.C D28.A R18.7 U5.25(OUT1) U5.26(OUT1) U5.27(OUT1) U10.1(IP+) U10.2(IP+)
N$55: D29.C D30.A R18.5 U5.22(OUT2) U5.23(OUT2) U5.24(OUT2) U11.1(IP+) U11.2(IP+)
N$56: D31.C D32.A R18.3 U5.19(OUT3) U5.20(OUT3) U5.21(OUT3) U12.1(IP+) U12.2(IP+)
N$57: D33.C D34.A R18.1 U5.16(OUT4) U5.17(OUT4) U5.18(OUT4) U13.1(IP+) U13.2(IP+)
N$58: AUX.6 U11.3(IP-) U11.4(IP-)
N$59: AUX.7 U12.3(IP-) U12.4(IP-)
N$60: AUX.8 U13.3(IP-) U13.4(IP-)
N$61: C1.2 U6.6(FILT)
N$64: C2.2 U7.6(FILT)
N$65: C3.2 U8.6(FILT)
N$66: C4.2 U9.6(FILT)
N$74: C9.2 U10.6(FILT)
N$75: C10.2 U11.6(FILT)
N$76: C11.2 U12.6(FILT)
N$77: C12.2 U13.6(FILT)

## Sheet 6 of 7
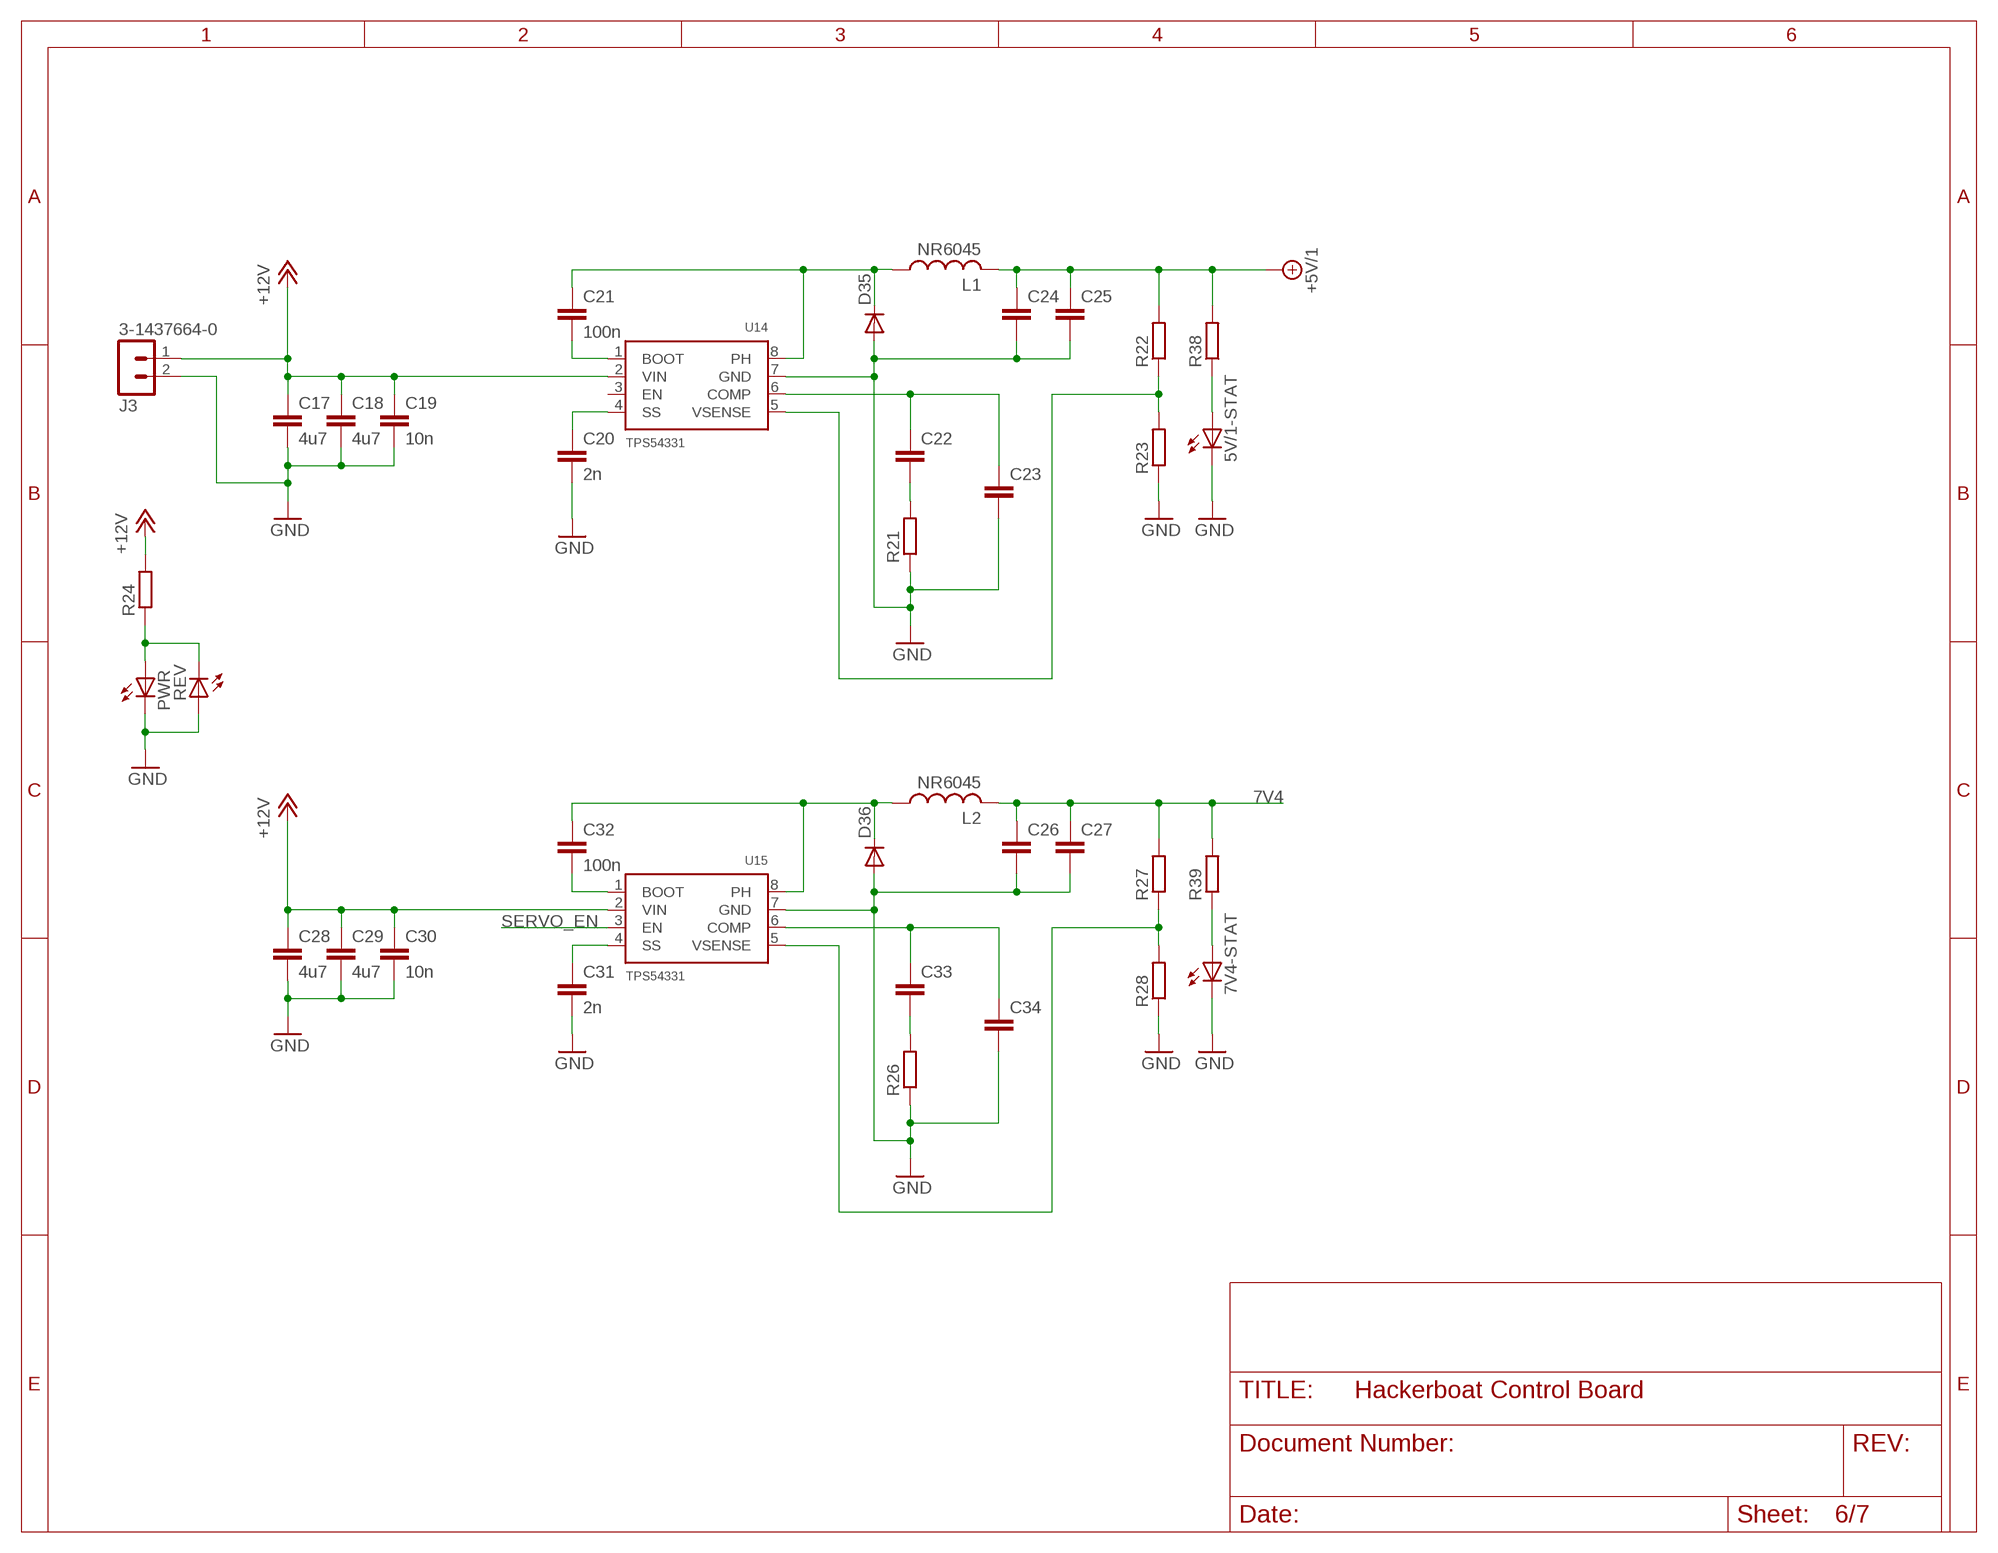
[diagram p5: schematic, sheet 6]

### Parts
5V/1-STAT  LEDCHIPLED_0805  [CHIPLED_0805]
7V4-STAT  LEDCHIPLED_0805  [CHIPLED_0805]
C17  4u7  C-EUC1210  [C1210]
C18  4u7  C-EUC1210  [C1210]
C19  10n  C-EUC0603  [C0603]
C20  2n  C-EUC0603  [C0603]
C21  100n  C-EUC0603  [C0603]
C22  C-EUC0603  [C0603]
C23  C-EUC0603  [C0603]
C24  C-EUC1210  [C1210]
C25  C-EUC1210  [C1210]
C26  C-EUC1210  [C1210]
C27  C-EUC1210  [C1210]
C28  4u7  C-EUC1210  [C1210]
C29  4u7  C-EUC1210  [C1210]
C30  10n  C-EUC0603  [C0603]
C31  2n  C-EUC0603  [C0603]
C32  100n  C-EUC0603  [C0603]
C33  C-EUC0603  [C0603]
C34  C-EUC0603  [C0603]
D35  SPARKFUN_DIODESMA  [SPARKFUN_SMA-DIODE]
D36  SPARKFUN_DIODESMA  [SPARKFUN_SMA-DIODE]
J3  3-1437664-0  [CONN-2]
L1  NR6045  [NR60XX]
L2  NR6045  [NR60XX]
PWR  LEDCHIPLED_0805  [CHIPLED_0805]
R21  R-EU_R0603  [R0603]
R22  R-EU_R0603  [R0603]
R23  R-EU_R0603  [R0603]
R24  R-EU_R0603  [R0603]
R26  R-EU_R0603  [R0603]
R27  R-EU_R0603  [R0603]
R28  R-EU_R0603  [R0603]
R38  R-EU_R0603  [R0603]
R39  R-EU_R0603  [R0603]
REV  LEDCHIPLED_0805  [CHIPLED_0805]
U14  TPS54331  [SO08]
U15  TPS54331  [SO08]

### Nets
7V4: C26.1 C27.1 L2.2 R27.2 R39.2 ; also sheet 7
+5V/1: C24.1 C25.1 L1.2 R22.2 R38.2 ; also sheet 2
+12V: C17.1 C18.1 C19.1 C28.1 C29.1 C30.1 J3.1 R24.2 U14.2(VIN) U15.2(VIN) ; also sheet 3,4,5
GND: 5V/1-STAT.C 7V4-STAT.C C17.2 C18.2 C19.2 C20.2 C23.2 C24.2 C25.2 C26.2 C27.2 C28.2 C29.2 C30.2 C31.2 C34.2 D35.A D36.A J3.2 PWR.C R21.1 R23.1 R26.1 R28.1 REV.A U14.7(GND) U15.7(GND) ; also sheet 1,2,3,4,5,7
N$62: C21.2 U14.1(BOOT)
N$63: C21.1 D35.C L1.1 U14.8(PH)
N$68: C22.2 R21.2
N$69: C20.1 U14.4(SS)
N$70: C22.1 C23.1 U14.6(COMP)
N$72: C31.1 U15.4(SS)
N$73: R22.1 R23.2 U14.5(VSENSE)
N$78: C32.2 U15.1(BOOT)
N$79: C32.1 D36.C L2.1 U15.8(PH)
N$80: C33.2 R26.2
N$81: C33.1 C34.1 U15.6(COMP)
N$82: R27.1 R28.2 U15.5(VSENSE)
N$177: PWR.A R24.1 REV.C
N$182: 5V/1-STAT.A R38.1
N$183: 7V4-STAT.A R39.1
SERVO_EN: U15.3(EN) ; also sheet 3
Unconnected: U14.3(EN)

## Sheet 7 of 7
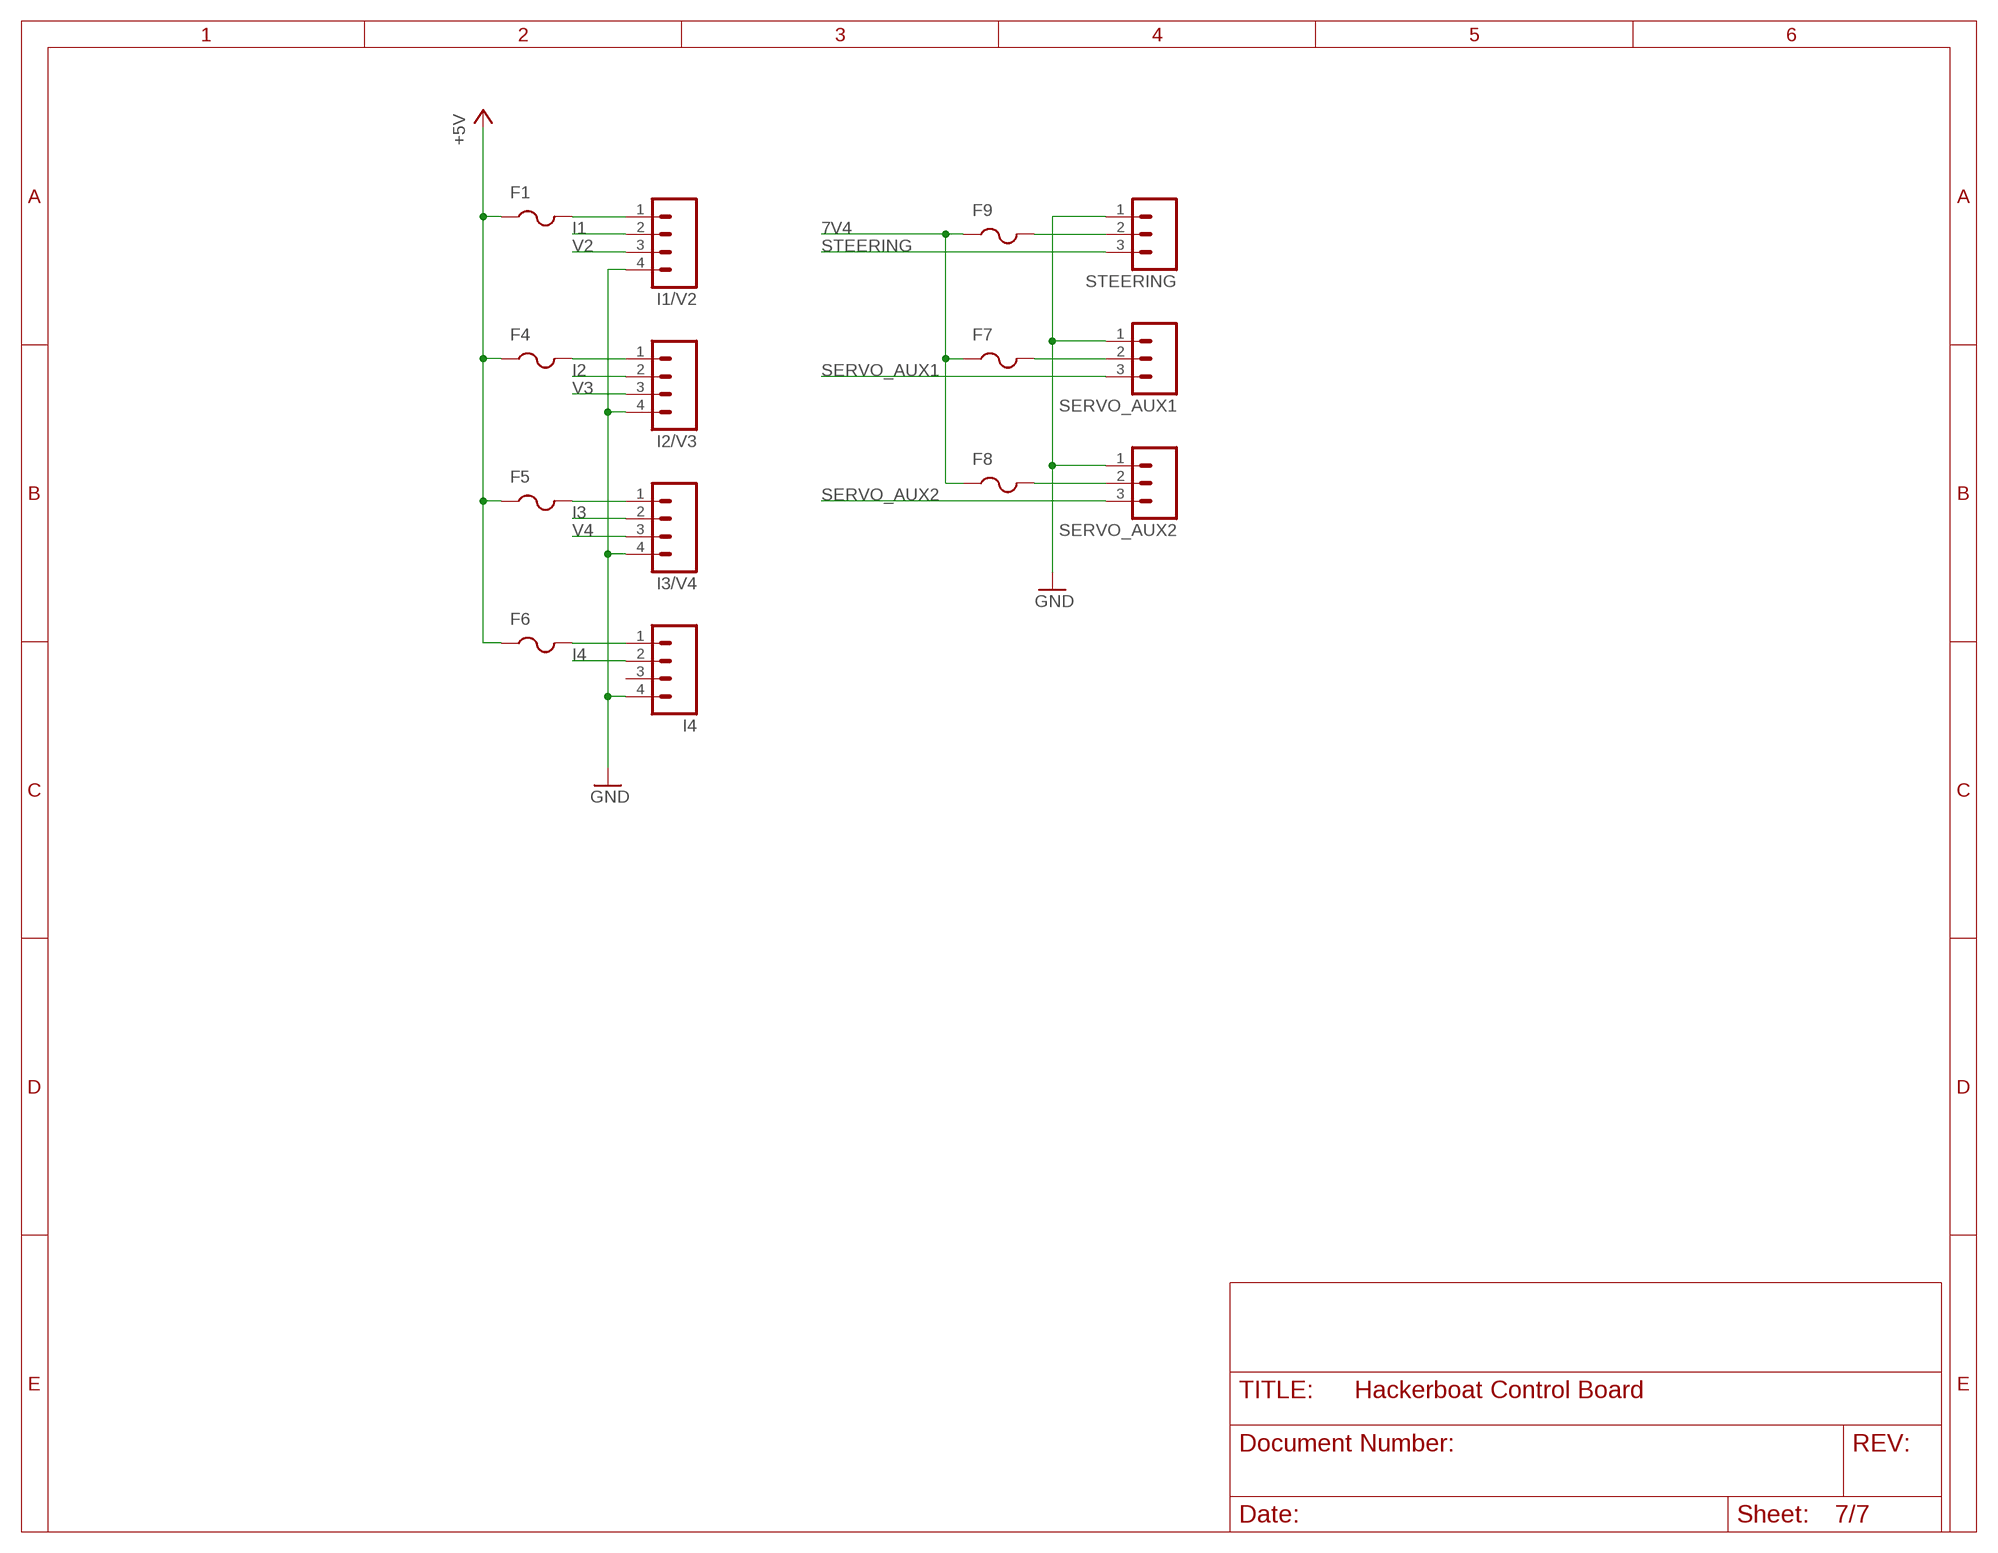
[diagram p6: schematic, sheet 7]

### Parts
F1  PTCFUSE-1206  [R1206]
F4  PTCFUSE-1206  [R1206]
F5  PTCFUSE-1206  [R1206]
F6  PTCFUSE-1206  [R1206]
F7  PTCFUSE-1206  [R1206]
F8  PTCFUSE-1206  [R1206]
F9  PTCFUSE-1206  [R1206]
I1/V2  M04LOCK_LONGPADS  [1X04_LOCK_LONGPADS]
I2/V3  M04LOCK_LONGPADS  [1X04_LOCK_LONGPADS]
I3/V4  M04LOCK_LONGPADS  [1X04_LOCK_LONGPADS]
I4  M04LOCK_LONGPADS  [1X04_LOCK_LONGPADS]
SERVO_AUX1  M03LOCK_LONGPADS  [1X03_LOCK_LONGPADS]
SERVO_AUX2  M03LOCK_LONGPADS  [1X03_LOCK_LONGPADS]
STEERING  M03LOCK_LONGPADS  [1X03_LOCK_LONGPADS]

### Nets
7V4: F7.1 F8.1 F9.1 ; also sheet 6
+5V: F1.1 F4.1 F5.1 F6.1 ; also sheet 3,4,5
GND: I1/V2.4 I2/V3.4 I3/V4.4 I4.4 SERVO_AUX1.1 SERVO_AUX2.1 STEERING.1 ; also sheet 1,2,3,4,5,6
I1: I1/V2.2 ; also sheet 3
I2: I2/V3.2 ; also sheet 3
I3: I3/V4.2 ; also sheet 3
I4: I4.2 ; also sheet 3
N$83: F1.2 I1/V2.1
N$86: F4.2 I2/V3.1
N$87: F5.2 I3/V4.1
N$88: F6.2 I4.1
N$89: F7.2 SERVO_AUX1.2
N$90: F8.2 SERVO_AUX2.2
N$93: F9.2 STEERING.2
SERVO_AUX1: SERVO_AUX1.3 ; also sheet 3
SERVO_AUX2: SERVO_AUX2.3 ; also sheet 3
STEERING: STEERING.3 ; also sheet 3
V2: I1/V2.3 ; also sheet 3
V3: I2/V3.3 ; also sheet 3
V4: I3/V4.3 ; also sheet 3
Unconnected: I4.3

## Library data of the parts
5V/1-STAT 7V4-STAT LED3-LED10 PWR REV = adafruit:LED: LED OSRAM: - CHIPLED LG R971, LG N971, LY N971, LG Q971, LY Q971, LO R971, LY R971 LH N974, LH R974 LS Q976, LO Q976, LY Q976 LO Q996 - Hyper CHIPLED LW Q18S LB Q993, LB Q99A, LB R99A - SideLED LS A670, LO A670, LY A670, LG A670, LP A670 LB A673, LV A673, LT A673, LW A673 LH A674 LY A675 LS A676, LA A676, LO A676, LY A676, LW A676 LS A679, LY A679, LG A679 - Hyper Micro SIDELED® LS Y876, LA Y876, LO Y876, LY Y876 LT Y87S - SmartLED LW L88C, LW L88S LB L89C, LB L89S, LG L890 LS L89K, LO L89K, LY L89K LS L896, LA L896, LO L896, LY L896 - TOPLED LS T670, LO T670, LY T670, LG T670, LP T670 LSG T670, LSP T670, LSY T670, LOP T670, LYG T670 LG T671, LOG T671, LSG T671 LB T673, LV T673, LT T673, LW T673 LH T674 LS T676, LA T676, LO T676, LY T676, LB T676, LH T676, LSB T676, LW T676 LB T67C, LV T67C, LT T67C, LS T67K, LO T67K, LY T67K, LW E67C LS E67B, LA E67B, LO E67B, LY E67B, LB E67C, LV E67C, LT E67C LW T67C LS T679, LY T679, LG T679 LS T770, LO T770, LY T770, LG T770, LP T770 LB T773, LV T773, LT T773, LW T773 LH T774 LS E675, LA E675, LY E675, LS T675 LS T776, LA T776, LO T776, LY T776, LB T776 LHGB T686 LT T68C, LB T68C - Hyper Mini TOPLED® LB M676 - Mini TOPLED Santana® LG M470 LS M47K, LO M47K, LY M47K Source: http://www.osram.convergy.de/
AUX RELAY = con-phoenix-350:1751303: MKDS 1/ 8-3,5 Printklemme Nennstrom: 10 A Bemessungsspannung: 160 V Raster: 3,5 mm Polzahl: 8 Montageart: Löten Anschlussart: Schraubanschluss Anschlussrichtung vom Leiter zur Platine: 0° Source: http://eshop.phoenixcontact.com .. .pdf; OC_FARNELL: unknown; OC_NEWARK: unknown
C1-C34 = resistor:C-EU: CAPACITOR, European symbol
D1 D2 = SparkFun-DiscreteSemi:DIODE-ZENER: Zener Diode Production Part - 8199 3.4V Zener Voltage; PROD_ID: DIO-11284
D3-D34 = adafruit:DIODE: Diode SMADIODE - SMA Surface Mount Package 20V 1A Schottky Diode Digikey: 641-1014-6-ND DO-1N4148 - Through Hole Small Current Diode SOD-123 20V 1 A (.5mV Vf) Schottky Diode - Digikey: MBRX120TPMSCT-ND SOD-323 10V 570mA (.38mV Vf, 3ns) Schottky Diode - Digikey: ZLLS410CT-ND SOD-523 30V 30mA Schottky Diode (RB751S-40TE61) - Digikey: RB751S-40TE61CT-ND SOT23-R/W - SOT23 Package (R = Solder Paste/Reflow Ovens, W = Hand-Soldering) BAT54Film 40V 300mA - Digikey: 497-7162-1-ND
D35 D36 = ARD-SRG-MOT8-1a:SPARKFUN_DIODE: Diode These are standard reverse protection diodes and small signal diodes. SMA package can handle up to about 1A. SOD-323 can handle about 200mA. What the SOD-323 package when ordering, there are some mfgs out there that are 5-pin packages.
F1 F4-F9 = adafruit:PTCFUSE: PTC fuses, resettable thermistors
GPS = adafruit-sensor-boards:ULTIMATE-GPS
H1-H7 = holes:MOUNT-PAD-ROUND: MOUNTING PAD, round
HTU21D = sparkfun-sensor-boards:HTU21D: HTU21D Breakout Board
I1/V2 I2/V3 I3/V4 I4 = SparkFun-Connectors:M04: Header 4 Standard 4-pin 0.1" header. Use with straight break away headers (SKU : PRT-00116), right angle break away headers (PRT-00553), swiss pins (PRT-00743), machine pins (PRT-00117), and female headers (PRT-00115). Molex polarized connector foot print use with SKU : PRT-08231 with associated crimp pins and housings. 1MM SMD Version SKU: PRT-10208
IMU = adafruit-sensor-boards:9-DOF-BREAKOUT
J3 = logos-headers:3-1437664-0: TE Connectivity 3-1437664-0
JP10-JP14 = SparkFun-Connectors:M08: Header 8 Standard 8-pin 0.1" header. Use with straight break away headers (SKU : PRT-00116), right angle break away headers (PRT-00553), swiss pins (PRT-00743), machine pins (PRT-00117), and female headers (PRT-00115).
JP15 JP16 = SparkFun-Connectors:M16: 1x16 .1" header
JP17 = SparkFun-Connectors:M06: Header 6 Standard 6-pin 0.1" header. Use with straight break away headers (SKU : PRT-00116), right angle break away headers (PRT-00553), swiss pins (PRT-00743), machine pins (PRT-00117), and female headers (PRT-00115). Molex polarized connector foot print use with SKU : PRT-08094 with associated crimp pins and housings. NOTES ON THE VARIANTS LOCK and LOCK_LONGPADS... This footprint was designed to help hold the alignment of a through-hole component (i.e. 6-pin header) while soldering it into place. You may notice that each hole has been shifted either up or down by 0.005 of an inch from it's more standard position (which is a perfectly straight line). This slight alteration caused the pins (the squares in the middle) to touch the edges of the holes. Because they are alternating, it causes a "brace" to hold the component in place. 0.005 has proven to be the perfect amount of "off-center" position when using our standard breakaway headers. Although looks a little odd when you look at the bare footprint, once you have a header in there, the alteration is very hard to notice. Also,if you push a header all the way into place, it is covered up entirely on the bottom side. This idea of altering the position of holes to aid alignment will be further integrated into the Sparkfun Library for other footprints. It can help hold any component with 3 or more connection pins.
L1 L2 = logos-inductors:NR60: Taiyo Yuden low profile power inductor
R1 R2 R19-R39 = resistor:R-EU_: RESISTOR, European symbol
R3-R18 = res-cap-arrays:4R-N: Array Chip Resistor Source: RS Component / Phycomp
SERVO_AUX1 SERVO_AUX2 STEERING = SparkFun-Connectors:M03: Header 3 Standard 3-pin 0.1" header. Use with straight break away headers (SKU : PRT-00116), right angle break away headers (PRT-00553), swiss pins (PRT-00743), machine pins (PRT-00117), and female headers (PRT-00115). Molex polarized connector foot print use with SKU : PRT-08232 with associated crimp pins and housings.
U1 U3-U5 = logos-faves:IPS6044
U2 = SparkFun-Boards:ARDUINO-MEGA: Arduino Mega board footprint
U6-U13 = allegro3:ACS71
U14 U15 = logos-power:TPS54331: 3-28V 3A buck regulator
U$1 = adafruit:BEAGLEBONE_OUTLINE: Should match A3 pinout - but not completely tested
U$2-U$5 = SparkFun-Connectors:M24: 1x24 .1" header